# Altium project 10X SD CARD READER.PrjPcb
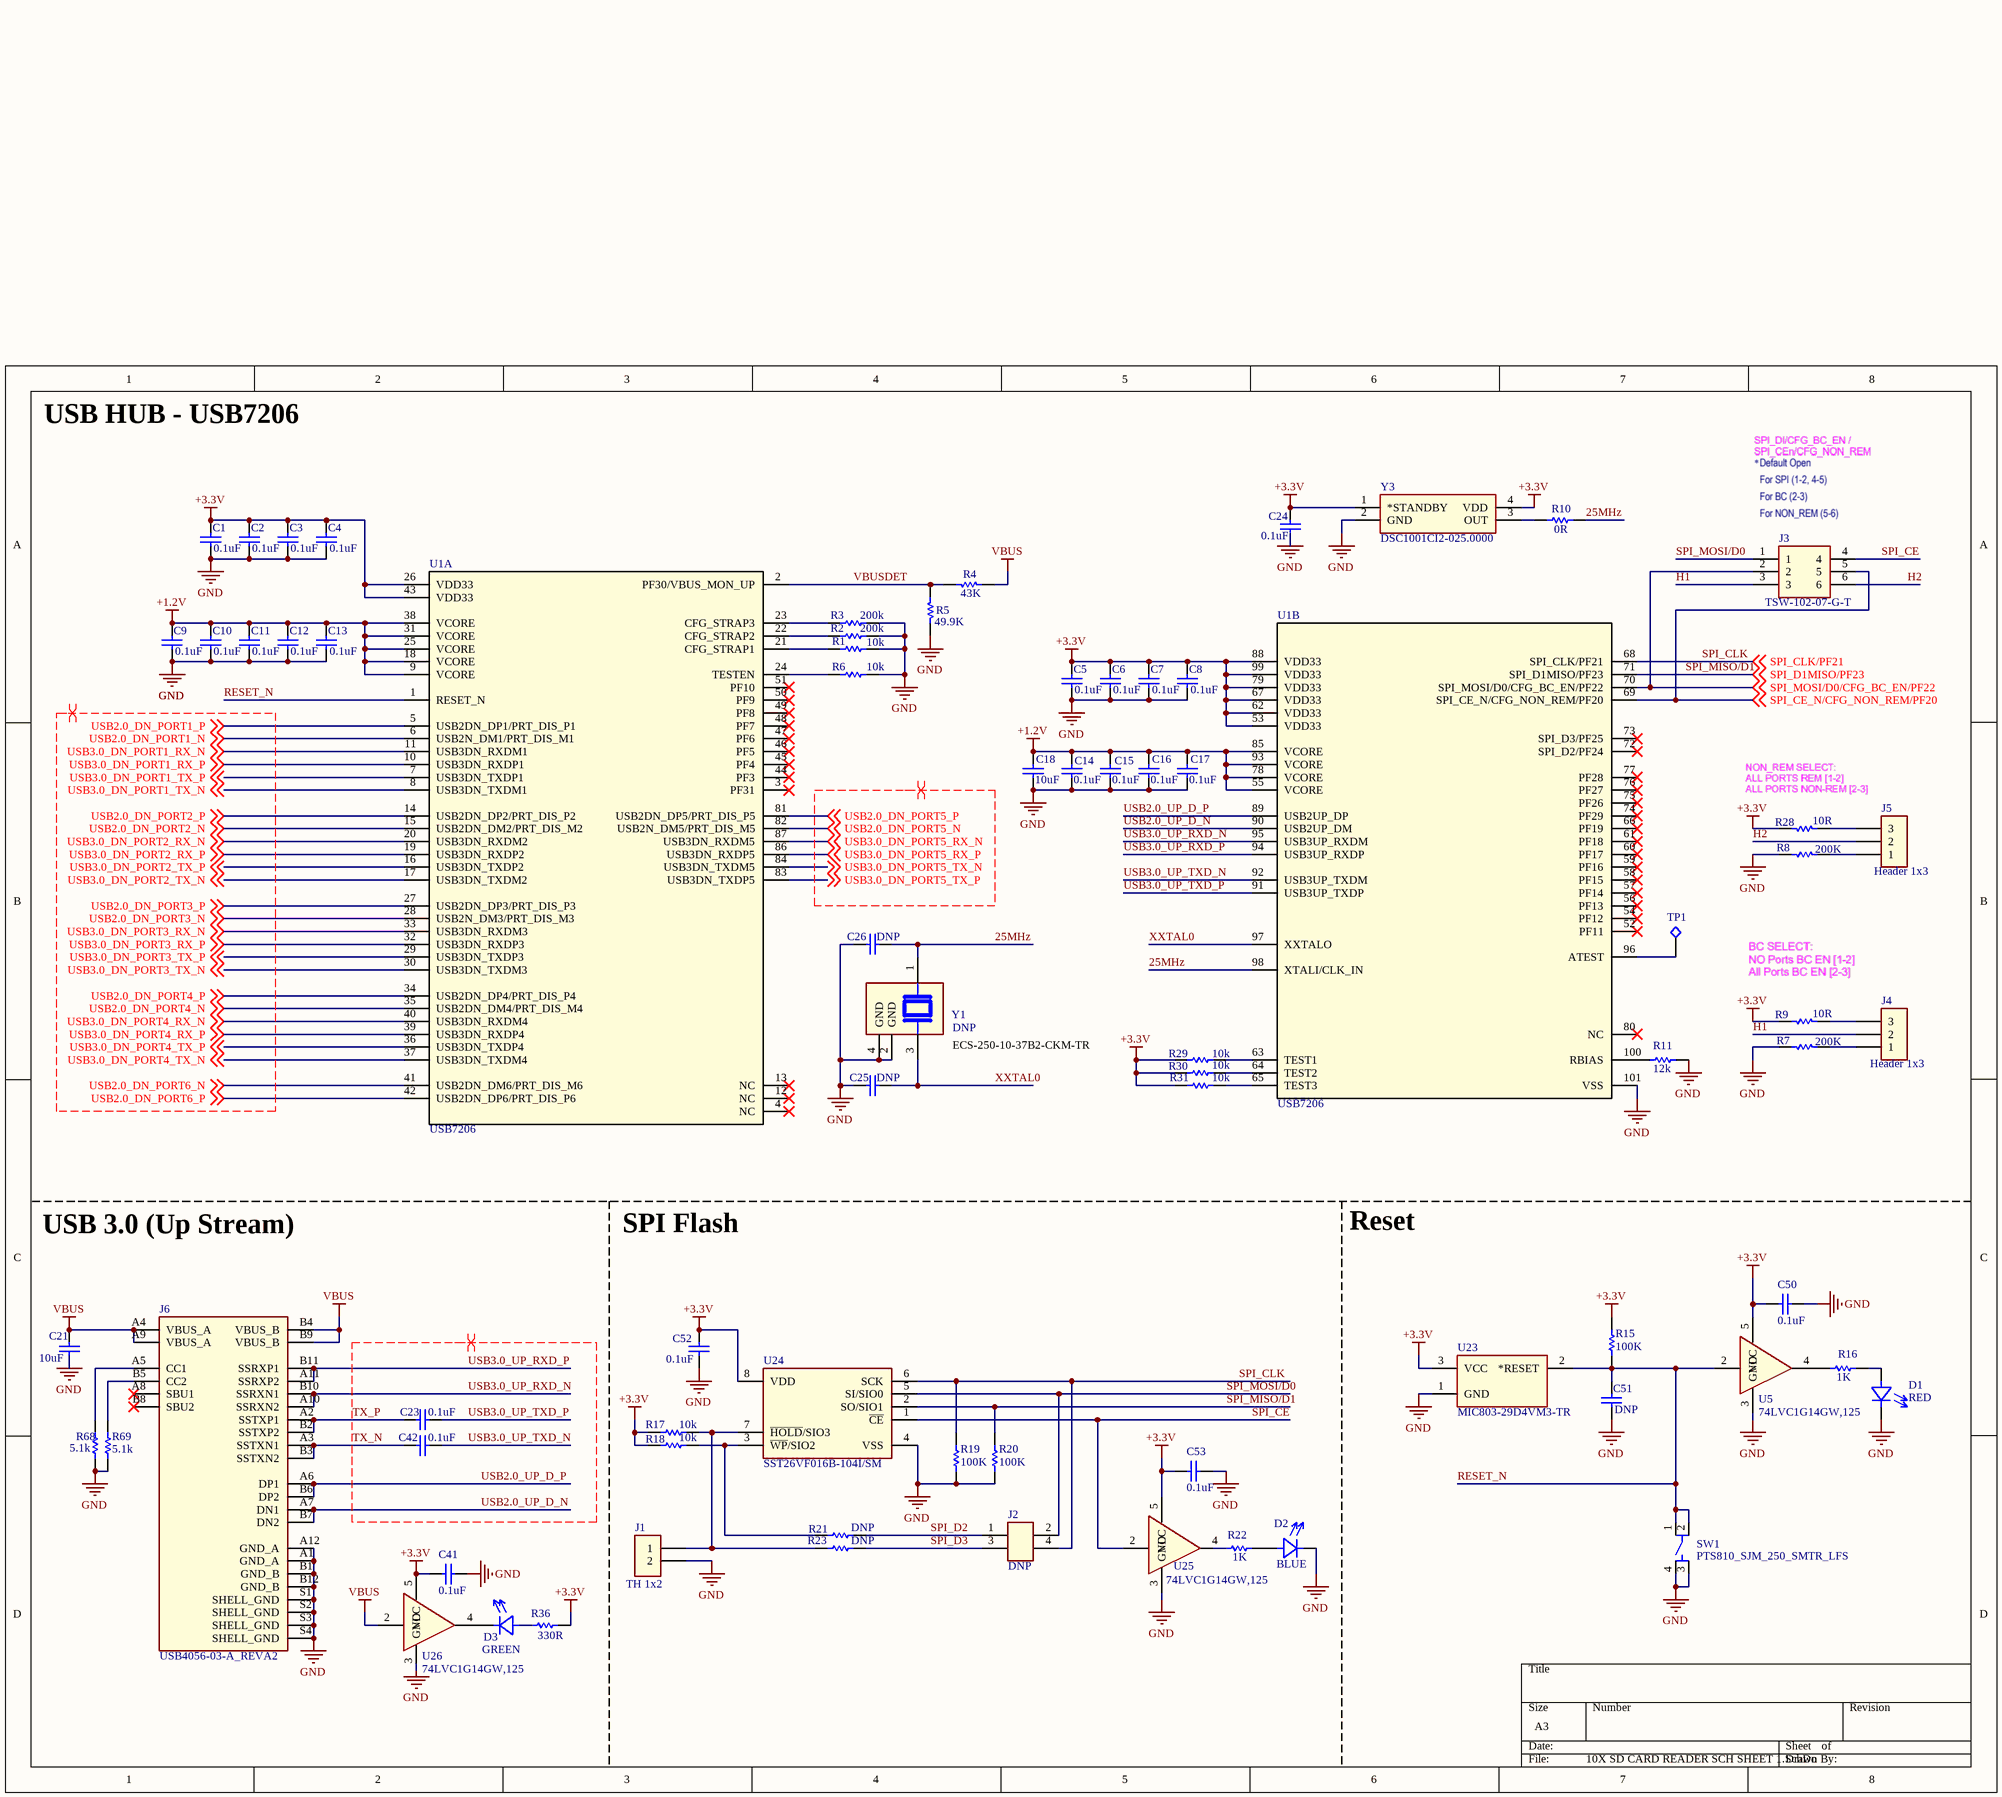
[diagram p0: 10X SD CARD READER SCH SHEET 1.SchDoc]
4 sheets, 309 parts. Net scope: global (net labels, ports and power ports of the same name join across sheets).
Board file: 10X SD CARD READER PCB.PcbDoc
Sheets:
  10X SD CARD READER SCH SHEET 1.SchDoc
  10X SD CARD READER SCH SHEET 2.SchDoc
  10X SD CARD READER SCH SHEET 3.SchDoc
  10X SD CARD READER SCH SHEET 4.SchDoc

## Sheet 10X SD CARD READER SCH SHEET 1.SchDoc
size A3

### Parts
C1  0.1uF  [C-0402/1005]
C2  0.1uF  [C-0402/1005]
C3  0.1uF  [C-0402/1005]
C4  0.1uF  [C-0402/1005]
C5  0.1uF  [C-0402/1005]
C6  0.1uF  [C-0402/1005]
C7  0.1uF  [C-0402/1005]
C8  0.1uF  [C-0402/1005]
C9  0.1uF  [C-0402/1005]
C10  0.1uF  [C-0402/1005]
C11  0.1uF  [C-0402/1005]
C12  0.1uF  [C-0402/1005]
C13  0.1uF  [C-0402/1005]
C14  0.1uF  [C-0402/1005]
C15  0.1uF  [C-0402/1005]
C16  0.1uF  [C-0402/1005]
C17  0.1uF  [C-0402/1005]
C18  10uF  [C-0805/2012]
C21  10uF  [C-0805/2012]
C23  0.1uF  [C-0402/1005]
C24  0.1uF  [C-0402/1005]
C25  DNP  [R-0402/1005]
C26  DNP  [R-0402/1005]
C41  0.1uF  [C-0402/1005]
C42  0.1uF  [C-0402/1005]
C50  0.1uF  [C-0402/1005]
C51  value DNP  [C-0402/1005]  (hidden comment: 0.1uF)
C52  0.1uF  [C-0402/1005]
C53  0.1uF  [C-0402/1005]
D1  RED  [LEDC1608X65N]
D2  BLUE  [LEDC1608X65N]
D3  GREEN  [LEDC1608X65N]
J1  TH 1x2  [PIN HEADER 1x2 2.54mm]
J2  DNP  [PIN HEADER 2x2 2.54mm]
J3  TSW-102-07-G-T  [CON6_3X2_TU_TSW_SAI]
J4  Header 1x3  [PIN HEADER 1x3 2.54mm]
J5  Header 1x3  [PIN HEADER 1x3 2.54mm]
J6  USB4056-03-A_REVA2  [GCT_USB4056-03-A_REVA2]
R1  10k  [R-0402/1005]
R2  200k  [R-0402/1005]
R3  200k  [R-0402/1005]
R4  43K  [R-0402/1005]
R5  49.9K  [R-0402/1005]
R6  10k  [R-0402/1005]
R7  200K  [R-0402/1005]
R8  200K  [R-0402/1005]
R9  10R  [R-0402/1005]
R10  0R  [R-0402/1005]
R11  12k  [R-0402/1005]
R15  100K  [R-0402/1005]
R16  1K  [R-0402/1005]
R17  10k  [R-0402/1005]
R18  10k  [R-0402/1005]
R19  100K  [R-0402/1005]
R20  100K  [R-0402/1005]
R21  DNP  [R-0402/1005]
R22  1K  [R-0402/1005]
R23  DNP  [R-0402/1005]
R28  10R  [R-0402/1005]
R29  10k  [R-0402/1005]
R30  10k  [R-0402/1005]
R31  10k  [R-0402/1005]
R36  330R  [R-0402/1005]
R68  5.1k  [R-0402/1005]
R69  5.1k  [R-0402/1005]
SW1  PTS810_SJM_250_SMTR_LFS  [SW_PTS810_SJM_250_SMTR_LFS]
TP1  Test Points  [Test Point TH Round H0.9,D1.6]  (value not drawn)
U1  USB7206  [USB7206]  (parts A,B of 2)
U5  74LVC1G14GW,125  [SOT65P212X110-5N]
U23  MIC803-29D4VM3-TR  [SOT-23_M3_MCH]
U24  SST26VF016B-104I/SM  [SOIC127P794X203-8N]
U25  74LVC1G14GW,125  [SOT65P212X110-5N]
U26  74LVC1G14GW,125  [SOT65P212X110-5N]
Y1  DNP  [ECS-250-10-37B2]
Y3  DSC1001CI2-025.0000  [CDFN4_3P2X2P5_MCH]

### Nets
+1.2V: C9.2 C10.2 C11.2 C12.2 C13.2 C14.1 C15.1 C16.2 C17.2 C18.2 U1.9(VCORE) U1.18(VCORE) U1.25(VCORE) U1.31(VCORE) U1.38(VCORE) U1.55(VCORE) U1.78(VCORE) U1.85(VCORE) U1.93(VCORE)
+3.3V: C1.2 C2.2 C3.2 C4.2 C5.2 C6.2 C7.2 C8.2 C24.2 C41.2 C50.2 C52.2 C53.2 R9.2 R15.1 R17.2 R18.2 R28.2 R29.2 R30.2 R31.2 R36.2 U1.26(VDD33) U1.43(VDD33) U1.53(VDD33) U1.62(VDD33) U1.67(VDD33) U1.79(VDD33) U1.88(VDD33) U1.99(VDD33) U5.5(VCC) U23.3(VCC) U24.8(VDD) U25.5(VCC) U26.5(VCC) Y3.1(*STANDBY) Y3.4(VDD)
GND: C1.1 C2.1 C3.1 C4.1 C5.1 C6.1 C7.1 C8.1 C9.1 C10.1 C11.1 C12.1 C13.1 C14.2 C15.2 C16.1 C17.1 C18.1 C21.1 C24.1 C25.2 C26.2 C41.1 C50.1 C51.1 C52.1 C53.1 D1.C D2.C J1.2 J6.A1(GND_A) J6.A12(GND_A) J6.B1(GND_B) J6.B12(GND_B) J6.S1(SHELL_GND) J6.S2(SHELL_GND) J6.S3(SHELL_GND) J6.S4(SHELL_GND) R1.2 R2.2 R3.2 R5.2 R6.1 R7.1 R8.1 R11.1 R19.2 R20.2 R68.1 R69.1 SW1.3 SW1.4 U1.101(VSS) U5.3(GND) U23.1(GND) U24.4(VSS) U25.3(GND) U26.3(GND) Y1.2(GND) Y1.4(GND) Y3.2(GND)
VBUS: C21.2 J6.A4(VBUS_A) J6.A9(VBUS_A) J6.B4(VBUS_B) J6.B9(VBUS_B) R4.2 U26.2(A)
25MHz: C26.1 R10.2 U1.98(XTALI/CLK_IN) Y1.1
H1: J3.3 J4.2
H2: J3.6 J5.2
RESET_N: C51.2 R15.2 SW1.1 SW1.2 U1.1(RESET_N) U5.2(A) U23.2(*RESET)
SPI_CE: J3.4 U24.1(~{CE}) U25.2(A)
SPI_CE_N/CFG_NON_REM/PF20: J3.5 U1.69(SPI_CE_N/CFG_NON_REM/PF20) ; off-sheet SPI_CE_N/CFG_NON_REM/PF20
SPI_CLK: J2.4 R19.1 U1.68(SPI_CLK/PF21) U24.6(SCK) ; off-sheet SPI_CLK/PF21  [also labelled SPI_CLK/PF21]
SPI_D2: J2.1 R21.2
SPI_D3: J2.3 R23.2
SPI_MISO/D1: R20.1 U1.71(SPI_D1MISO/PF23) U24.2(SO/SIO1) ; off-sheet SPI_D1MISO/PF23  [also labelled SPI_D1MISO/PF23]
SPI_MOSI/D0: J2.2 J3.1 U24.5(SI/SIO0)
SPI_MOSI/D0/CFG_BC_EN/PF22: J3.2 U1.70(SPI_MOSI/D0/CFG_BC_EN/PF22) ; off-sheet SPI_MOSI/D0/CFG_BC_EN/PF22
TX_N: C42.2 J6.A3(SSTXN1) J6.B3(SSTXN2)
TX_P: C23.2 J6.A2(SSTXP1) J6.B2(SSTXP2)
USB2.0_DN_PORT1_N: U1.6(USB2N_DM1/PRT_DIS_M1) ; off-sheet USB2.0_DN_PORT1_N
USB2.0_DN_PORT1_P: U1.5(USB2DN_DP1/PRT_DIS_P1) ; off-sheet USB2.0_DN_PORT1_P
USB2.0_DN_PORT2_N: U1.15(USB2DN_DM2/PRT_DIS_M2) ; off-sheet USB2.0_DN_PORT2_N
USB2.0_DN_PORT2_P: U1.14(USB2DN_DP2/PRT_DIS_P2) ; off-sheet USB2.0_DN_PORT2_P
USB2.0_DN_PORT3_N: U1.28(USB2N_DM3/PRT_DIS_M3) ; off-sheet USB2.0_DN_PORT3_N
USB2.0_DN_PORT3_P: U1.27(USB2DN_DP3/PRT_DIS_P3) ; off-sheet USB2.0_DN_PORT3_P
USB2.0_DN_PORT4_N: U1.35(USB2DN_DM4/PRT_DIS_M4) ; off-sheet USB2.0_DN_PORT4_N
USB2.0_DN_PORT4_P: U1.34(USB2DN_DP4/PRT_DIS_P4) ; off-sheet USB2.0_DN_PORT4_P
USB2.0_DN_PORT5_N: U1.82(USB2N_DM5/PRT_DIS_M5) ; off-sheet USB2.0_DN_PORT5_N
USB2.0_DN_PORT5_P: U1.81(USB2DN_DP5/PRT_DIS_P5) ; off-sheet USB2.0_DN_PORT5_P
USB2.0_DN_PORT6_N: U1.41(USB2DN_DM6/PRT_DIS_M6) ; off-sheet USB2.0_DN_PORT6_N
USB2.0_DN_PORT6_P: U1.42(USB2DN_DP6/PRT_DIS_P6) ; off-sheet USB2.0_DN_PORT6_P
USB2.0_UP_D_N: J6.A7(DN1) J6.B7(DN2) U1.90(USB2UP_DM)
USB2.0_UP_D_P: J6.A6(DP1) J6.B6(DP2) U1.89(USB2UP_DP)
USB3.0_DN_PORT1_RX_N: U1.11(USB3DN_RXDM1) ; off-sheet USB3.0_DN_PORT1_RX_N
USB3.0_DN_PORT1_RX_P: U1.10(USB3DN_RXDP1) ; off-sheet USB3.0_DN_PORT1_RX_P
USB3.0_DN_PORT1_TX_N: U1.8(USB3DN_TXDM1) ; off-sheet USB3.0_DN_PORT1_TX_N
USB3.0_DN_PORT1_TX_P: U1.7(USB3DN_TXDP1) ; off-sheet USB3.0_DN_PORT1_TX_P
USB3.0_DN_PORT2_RX_N: U1.20(USB3DN_RXDM2) ; off-sheet USB3.0_DN_PORT2_RX_N
USB3.0_DN_PORT2_RX_P: U1.19(USB3DN_RXDP2) ; off-sheet USB3.0_DN_PORT2_RX_P
USB3.0_DN_PORT2_TX_N: U1.17(USB3DN_TXDM2) ; off-sheet USB3.0_DN_PORT2_TX_N
USB3.0_DN_PORT2_TX_P: U1.16(USB3DN_TXDP2) ; off-sheet USB3.0_DN_PORT2_TX_P
USB3.0_DN_PORT3_RX_N: U1.33(USB3DN_RXDM3) ; off-sheet USB3.0_DN_PORT3_RX_N
USB3.0_DN_PORT3_RX_P: U1.32(USB3DN_RXDP3) ; off-sheet USB3.0_DN_PORT3_RX_P
USB3.0_DN_PORT3_TX_N: U1.30(USB3DN_TXDM3) ; off-sheet USB3.0_DN_PORT3_TX_N
USB3.0_DN_PORT3_TX_P: U1.29(USB3DN_TXDP3) ; off-sheet USB3.0_DN_PORT3_TX_P
USB3.0_DN_PORT4_RX_N: U1.40(USB3DN_RXDM4) ; off-sheet USB3.0_DN_PORT4_RX_N
USB3.0_DN_PORT4_RX_P: U1.39(USB3DN_RXDP4) ; off-sheet USB3.0_DN_PORT4_RX_P
USB3.0_DN_PORT4_TX_N: U1.37(USB3DN_TXDM4) ; off-sheet USB3.0_DN_PORT4_TX_N
USB3.0_DN_PORT4_TX_P: U1.36(USB3DN_TXDP4) ; off-sheet USB3.0_DN_PORT4_TX_P
USB3.0_DN_PORT5_RX_N: U1.87(USB3DN_RXDM5) ; off-sheet USB3.0_DN_PORT5_RX_N
USB3.0_DN_PORT5_RX_P: U1.86(USB3DN_RXDP5) ; off-sheet USB3.0_DN_PORT5_RX_P
USB3.0_DN_PORT5_TX_N: U1.84(USB3DN_TXDM5) ; off-sheet USB3.0_DN_PORT5_TX_N
USB3.0_DN_PORT5_TX_P: U1.83(USB3DN_TXDP5) ; off-sheet USB3.0_DN_PORT5_TX_P
USB3.0_UP_RXD_N: J6.A10(SSRXN2) J6.B10(SSRXN1) U1.95(USB3UP_RXDM)
USB3.0_UP_RXD_P: J6.A11(SSRXP2) J6.B11(SSRXP1) U1.94(USB3UP_RXDP)
USB3.0_UP_TXD_N: C42.1 U1.92(USB3UP_TXDM)
USB3.0_UP_TXD_P: C23.1 U1.91(USB3UP_TXDP)
VBUSDET: R4.1 R5.1 U1.2(PF30/VBUS_MON_UP)
XXTAL0: C25.1 U1.97(XXTALO) Y1.3
NetD1_A: D1.A R16.1
NetD2_A: D2.A R22.1
NetD3_A: D3.A R36.1
NetD3_C: D3.C U26.4(~{Y})
NetJ1_1: J1.1 R17.1 R23.1 U24.7(~{HOLD}/SIO3)
NetJ4_1: J4.1 R7.2
NetJ4_3: J4.3 R9.1
NetJ5_1: J5.1 R8.2
NetJ5_3: J5.3 R28.1
NetJ6_A5: J6.A5(CC1) R68.2
NetJ6_B5: J6.B5(CC2) R69.2
NetR1_1: R1.1 U1.21(CFG_STRAP1)
NetR2_1: R2.1 U1.22(CFG_STRAP2)
NetR3_1: R3.1 U1.23(CFG_STRAP3)
NetR6_2: R6.2 U1.24(TESTEN)
NetR10_1: R10.1 Y3.3(OUT)
NetR11_2: R11.2 U1.100(RBIAS)
NetR16_2: R16.2 U5.4(~{Y})
NetR18_1: R18.1 R21.1 U24.3(~{WP}/SIO2)
NetR22_2: R22.2 U25.4(~{Y})
NetR29_1: R29.1 U1.63(TEST1)
NetR30_1: R30.1 U1.64(TEST2)
NetR31_1: R31.1 U1.65(TEST3)
NetTP1_1: TP1.1 U1.96(ATEST)

Not connected (* = marked no-connect by the designer): J6 A8(SBU1)* B8(SBU2)*; U1 3(PF31)* 4(NC)* 12(NC)* 13(NC)* 44(PF3)* 45(PF4)* 46(PF5)* 47(PF6)* 48(PF7)* 49(PF8)* 50(PF9)* 51(PF10)* 52(PF11)* 54(PF12)* 56(PF13)* 57(PF14)* 58(PF15)* 59(PF16)* 60(PF17)* 61(PF18)* 66(PF19)* 72(SPI_D2/PF24)* 73(SPI_D3/PF25)* 74(PF29)* 75(PF26)* 76(PF27)* 77(PF28)* 80(NC)*

### Layout directives
differential pair; differential pair class Diff_90R: TX_N, TX_P, USB2.0_DN_PORT1_N, USB2.0_DN_PORT1_P, USB2.0_DN_PORT2_N, USB2.0_DN_PORT2_P, USB2.0_DN_PORT3_N, USB2.0_DN_PORT3_P, USB2.0_DN_PORT4_N, USB2.0_DN_PORT4_P, USB2.0_DN_PORT5_N, USB2.0_DN_PORT5_P, USB2.0_DN_PORT6_N, USB2.0_DN_PORT6_P, USB2.0_UP_D_N, USB2.0_UP_D_P, USB3.0_DN_PORT1_RX_N, USB3.0_DN_PORT1_RX_P, USB3.0_DN_PORT1_TX_N, USB3.0_DN_PORT1_TX_P, USB3.0_DN_PORT2_RX_N, USB3.0_DN_PORT2_RX_P, USB3.0_DN_PORT2_TX_N, USB3.0_DN_PORT2_TX_P, USB3.0_DN_PORT3_RX_N, USB3.0_DN_PORT3_RX_P, USB3.0_DN_PORT3_TX_N, USB3.0_DN_PORT3_TX_P, USB3.0_DN_PORT4_RX_N, USB3.0_DN_PORT4_RX_P, USB3.0_DN_PORT4_TX_N, USB3.0_DN_PORT4_TX_P, USB3.0_DN_PORT5_RX_N, USB3.0_DN_PORT5_RX_P, USB3.0_DN_PORT5_TX_N, USB3.0_DN_PORT5_TX_P, USB3.0_UP_RXD_N, USB3.0_UP_RXD_P, USB3.0_UP_TXD_N, USB3.0_UP_TXD_P

### Notes on the sheet
- USB HUB - USB7206
- (near Y1) ECS-250-10-37B2-CKM-TR
- USB 3.0 (Up Stream)
- SPI Flash
- Reset

### Library data of the parts
C1-C18 C23 C24 C41 C42 C50-C53 = Cap: Capacitor; Published: 8-Jun-2000; LatestRevisionDate: 17-Jul-2002; LatestRevisionNote: Re-released for DXP Platform.; PackageReference: RAD-0.3; Publisher: Altium Limited; PackageDescription: Radial Cap, Thru-Hole; 2 Leads; 0.3 in Pin Spacing
  C1-C17 C23 C24 C41 C42 C50 C52 C53: Value: 0.1uF
  C18: Value: 10uF
C21 C25 C26 = Cap: Capacitor; Value: 0.1uF; Published: 8-Jun-2000; LatestRevisionDate: 17-Jul-2002; LatestRevisionNote: Re-released for DXP Platform.; PackageReference: RAD-0.3; Publisher: Altium Limited; PackageDescription: Radial Cap, Thru-Hole; 2 Leads; 0.3 in Pin Spacing
D1-D3 = Diode-LED: Supplier: Digikey Electronics
J1 = Header 1x2: CONN HEADER VERT 3POS 2.54MM; Mfr. Part No.: 75160-156-03LF; Value: 51R; Unit Price (USD): 0.74; Supplier Part No.: 609-75160-156-03LF-ND; Supplier: Digikey Electronics
J2 = Header 2x2: FIXED IND 22UH 620MA 350 MOHM; Mfr. Part No.: PH2-04-UA; Unit Price (USD): 0.1; Supplier Part No.: 2057-PH2-04-UA-ND; Supplier: Digikey Electronics
J3 = TSW-102-07-G-T: No Description Available; Mfr_Name: Samtec Inc; Copyright: Copyright (C) 2023 Ultra Librarian. All rights reserved.; Manufacturer_Part_Number: TSW-102-07-G-T; Digi-Key_Part_Number_1: TSW-102-07-G-T-ND; RefDes: RefDes; Type: DEV
J4 J5 = Header 1x3: CONN HEADER VERT 3POS 2.54MM; Mfr. Part No.: 75160-156-03LF; Value: 51R; Unit Price (USD): 0.74; Supplier Part No.: 609-75160-156-03LF-ND; Supplier: Digikey Electronics
J6 = USB4056-03-A_REVA2: USB-C (USB TYPE-C) USB 3.2 Gen 2 (USB 3.1 Gen 2, Superspeed + (USB 3.1)) Receptacle Connector 24 Position Surface Mount, Right Angle; Through Hole; MF: Global Connector Technology; Package: None; Check_prices: https://www.snapeda.com/parts/USB4056-03-A/Global+Connector+Technology/view-part/?ref=eda; Value: *; Availability: In Stock; SnapEDA_Link: https://www.snapeda.com/parts/USB4056-03-A/Global+Connector+Technology/view-part/?ref=snap; MP: USB4056-03-A; Price: None
R1-R3 R6 R17 R18 R29-R31 = Res1: Resistor; Published: 8-Jun-2000; LatestRevisionDate: 17-Jul-2002; LatestRevisionNote: Re-released for DXP Platform.; PackageReference: AXIAL-0.3; Publisher: Altium Limited; PackageDescription: Axial Device, Thru-Hole; 2 Leads; 0.3 in Pin Spacing
  R1 R6 R17 R18 R29-R31: Value: 10K
  R2 R3: Value: 200K
R4 R5 R7-R9 R11 R15 R16 R19 R20 R22 R28 R36 = Res1: Resistor; Value: 10K; Published: 8-Jun-2000; LatestRevisionDate: 17-Jul-2002; LatestRevisionNote: Re-released for DXP Platform.; PackageReference: AXIAL-0.3; Publisher: Altium Limited; PackageDescription: Axial Device, Thru-Hole; 2 Leads; 0.3 in Pin Spacing
R10 R21 R23 R68 R69 = Res1: Resistor; Value: 200K; Published: 8-Jun-2000; LatestRevisionDate: 17-Jul-2002; LatestRevisionNote: Re-released for DXP Platform.; PackageReference: AXIAL-0.3; Publisher: Altium Limited; PackageDescription: Axial Device, Thru-Hole; 2 Leads; 0.3 in Pin Spacing
SW1 = PTS810_SJM_250_SMTR_LFS: Tactile Switch SPST-NO Top Actuated Surface Mount; MF: C&K; MP: PTS810 SJM 250 SMTR LFS; Price: None; Package: None; Availability: Unavailable; Value: *; SnapEDA_Link: https://www.snapeda.com/parts/PTS810%20SJM%20250%20SMTR%20LFS/C%26K/view-part/522770/?ref=snap
U1 = USB7206: IC USB3.1 GEN2 HUB TYPE C; Manufacturer: Microchip Technology; Manufacturer Product Number: USB7206CT-I/KDX; Digi-Key Part Number: 150-USB7206CT-I/KDXTR-ND; Unit Price: $12.9; Stock: 4935
U5 U25 U26 = 74LVC1G14GW,125: Inverter Schmitt Trigger 1-Element CMOS 5-Pin TSSOP T/R; Price: None; Availability: Unavailable; MP: 74LVC1G14GW,125; Value: *; Package: None
U23 = MIC803-29D4VM3-TR: No Description Available; Mfr_Name: Microchip; Copyright: Copyright (C) 2023 Ultra Librarian. All rights reserved.; Manufacturer_Part_Number: MIC803-29D4VM3-TR; Digi-Key_Part_Number_1: 576-3806-1-ND; Digi-Key_Part_Number_2: 576-3806-2-ND; Digi-Key_Part_Number_3: 576-3806-6-ND; RefDes: RefDes; Type: DEV
Y1 = ECS-250-10-37B2-CKM-TR
Y3 = DSC1001CI2-025.0000: No Description Available; Mfr_Name: Microchip; Copyright: Copyright (C) 2023 Ultra Librarian. All rights reserved.; Manufacturer_Part_Number: DSC1001CI2-025.0000; Digi-Key_Part_Number_1: 576-4957-5-ND; RefDes: RefDes; Type: DEV

## Sheet 10X SD CARD READER SCH SHEET 2.SchDoc
size A3
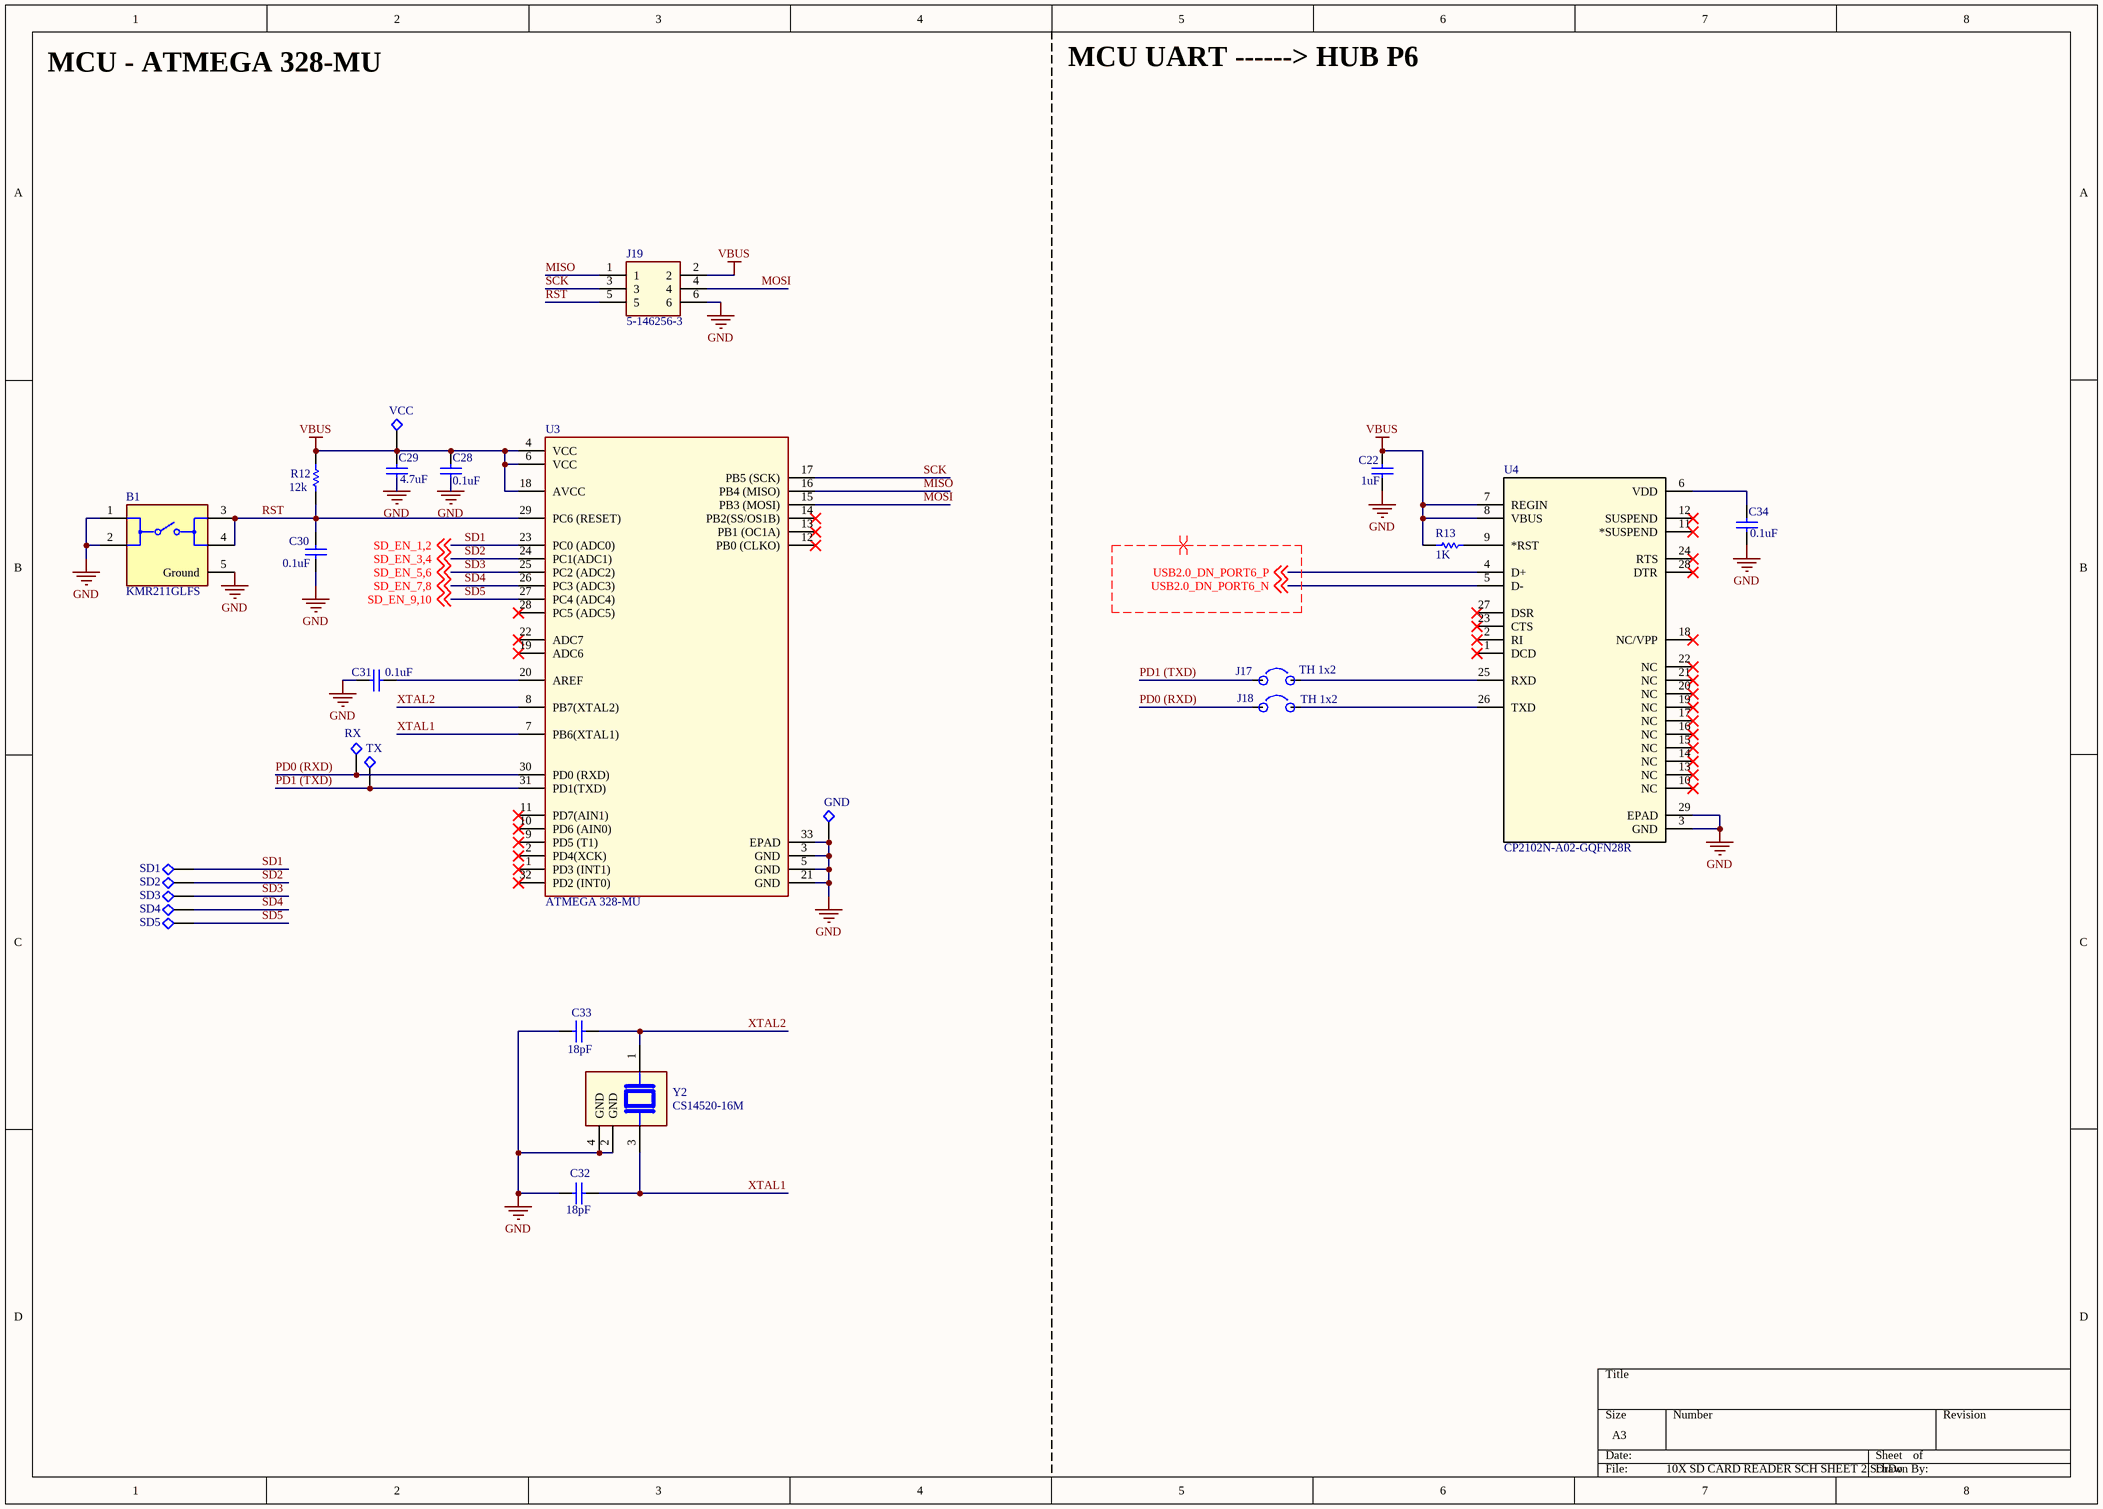
[diagram p1: 10X SD CARD READER SCH SHEET 2.SchDoc]

### Parts
B1  KMR211GLFS  [FP-KMR211GLFS-MFG]
C22  1uF  [C-0402/1005]
C28  0.1uF  [C-0402/1005]
C29  4.7uF  [0805-CAP]
C30  0.1uF  [C-0402/1005]
C31  0.1uF  [C-0402/1005]
C32  18pF  [C-0402/1005]
C33  18pF  [C-0402/1005]
C34  0.1uF  [C-0402/1005]
GND  Test Points  [Test Point TH Round H0.9,D1.6]  (value not drawn)
J17  TH 1x2  [PIN HEADER 1x2 2.54mm]
J18  TH 1x2  [PIN HEADER 1x2 2.54mm]
J19  5-146256-3  [TE_5-146256-3]
R12  12k  [R-0402/1005]
R13  1K  [R-0402/1005]
RX  Test Points  [Test Point TH Round H0.9,D1.6]  (value not drawn)
SD1  Test Points  [Test Point TH Round H0.9,D1.6]  (value not drawn)
SD2  Test Points  [Test Point TH Round H0.9,D1.6]  (value not drawn)
SD3  Test Points  [Test Point TH Round H0.9,D1.6]  (value not drawn)
SD4  Test Points  [Test Point TH Round H0.9,D1.6]  (value not drawn)
SD5  Test Points  [Test Point TH Round H0.9,D1.6]  (value not drawn)
TX  Test Points  [Test Point TH Round H0.9,D1.6]  (value not drawn)
U3  ATMEGA 328-MU  [ATMEGA 328P]
U4  CP2102N-A02-GQFN28R  [CP2102]
VCC  Test Points  [Test Point TH Round H0.9,D1.6]  (value not drawn)
Y2  CS14520-16M  [FL1600044]

### Nets
GND: B1.1 B1.2 B1.5(Ground) C22.2 C28.2 C29.2 C30.1 C31.1 C32.2 C33.2 C34.2 GND.1 J19.6 U3.3(GND) U3.5(GND) U3.21(GND) U3.33(EPAD) U4.3(GND) U4.29(EPAD) Y2.2(GND) Y2.4(GND)
VBUS: C22.1 C28.1 C29.1 J19.2 R12.1 R13.1 U3.4(VCC) U3.6(VCC) U3.18(AVCC) U4.7(REGIN) U4.8(VBUS) VCC.1
MISO: J19.1 U3.16(PB4_(MISO))
MOSI: J19.4 U3.15(PB3_(MOSI))
PD0 (RXD): J18.1 RX.1 U3.30(PD0_(RXD))
PD1 (TXD): J17.1 TX.1 U3.31(PD1(TXD))
RST: B1.3 B1.4 C30.2 J19.5 R12.2 U3.29(PC6_(RESET))
SCK: J19.3 U3.17(PB5_(SCK))
SD1: SD1.1 U3.23(PC0_(ADC0)) ; off-sheet SD_EN_1,2  [also labelled SD_EN_1,2]
SD2: SD2.1 U3.24(PC1(ADC1)) ; off-sheet SD_EN_3,4  [also labelled SD_EN_3,4]
SD3: SD3.1 U3.25(PC2_(ADC2)) ; off-sheet SD_EN_5,6  [also labelled SD_EN_5,6]
SD4: SD4.1 U3.26(PC3_(ADC3)) ; off-sheet SD_EN_7,8  [also labelled SD_EN_7,8]
SD5: SD5.1 U3.27(PC4_(ADC4)) ; off-sheet SD_EN_9,10  [also labelled SD_EN_9,10]
USB2.0_DN_PORT6_N: U4.5(D-) ; off-sheet USB2.0_DN_PORT6_N
USB2.0_DN_PORT6_P: U4.4(D+) ; off-sheet USB2.0_DN_PORT6_P
XTAL1: C32.1 U3.7(PB6(XTAL1)) Y2.3
XTAL2: C33.1 U3.8(PB7(XTAL2)) Y2.1
NetC31_2: C31.2 U3.20(AREF)
NetC34_1: C34.1 U4.6(VDD)
NetJ17_2: J17.2 U4.25(RXD)
NetJ18_2: J18.2 U4.26(TXD)
NetR13_2: R13.2 U4.9(*RST)

Not connected (* = marked no-connect by the designer): U3 1(PD3_(INT1))* 2(PD4(XCK))* 9(PD5_(T1))* 10(PD6_(AIN0))* 11(PD7(AIN1))* 12(PB0_(CLKO))* 13(PB1_(OC1A))* 14(PB2(SS/OS1B))* 19(ADC6)* 22(ADC7)* 28(PC5_(ADC5))* 32(PD2_(INT0))*; U4 1(DCD)* 2(RI)* 10(NC)* 11(*SUSPEND)* 12(SUSPEND)* 13(NC)* 14(NC)* 15(NC)* 16(NC)* 17(NC)* 18(NC/VPP)* 19(NC)* 20(NC)* 21(NC)* 22(NC)* 23(CTS)* 24(RTS)* 27(DSR)* 28(DTR)*

### Layout directives
differential pair; differential pair class Diff_90R: USB2.0_DN_PORT6_N, USB2.0_DN_PORT6_P

### Notes on the sheet
- MCU - ATMEGA 328-MU
- MCU UART ------> HUB P6

### Library data of the parts
B1 = CMP-10040-000023-1: SWITCH TACTILE SPST-NO 0.05A 32V; Switch Function: Off-Mom; Throw Configuration: SPST; Switch Travel: 0.2mm; Current Rating: 50mA; Illumination Type: Non-Illuminated; Actuator Length: 0.5mm; Power Rating: 1W; Operating Force: 1.2N; Actuator Type: Standard; Mechanical Life: 200000Cycles; REACH SVHC: No SVHC; Voltage Rating (DC): 32V; Length: 2.8mm; Min Operating Temperature: -40°C; Mount: Surface Mount; Max Voltage Rating (DC): 32V; Width: 2.8mm; Depth: 4.6mm; Packaging: Tape and Reel; Lead Free: Lead Free; Contact Material: Silver; Termination: Gull Wing; Package Quantity: 1; Contact Current Rating: 50mA; Orientation: Straight; Max Operating Temperature: 85°C; Radiation Hardening: No; Max Current Rating: 50mA; Contact Plating: Silver
C22 C34 = Cap: Capacitor; Value: 4.7uF; Published: 8-Jun-2000; LatestRevisionDate: 17-Jul-2002; LatestRevisionNote: Re-released for DXP Platform.; PackageReference: RAD-0.3; Publisher: Altium Limited; PackageDescription: Radial Cap, Thru-Hole; 2 Leads; 0.3 in Pin Spacing
C28 = Cap: Capacitor; Value: 100nF; Published: 8-Jun-2000; LatestRevisionDate: 17-Jul-2002; LatestRevisionNote: Re-released for DXP Platform.; PackageReference: RAD-0.3; Publisher: Altium Limited; PackageDescription: Radial Cap, Thru-Hole; 2 Leads; 0.3 in Pin Spacing
C29-C31 = Cap: Capacitor; Published: 8-Jun-2000; LatestRevisionDate: 17-Jul-2002; LatestRevisionNote: Re-released for DXP Platform.; PackageReference: RAD-0.3; Publisher: Altium Limited; PackageDescription: Radial Cap, Thru-Hole; 2 Leads; 0.3 in Pin Spacing
  C29: Value: 4.7uF
  C30 C31: Value: 0.1uF
C32 C33 = Cap: Capacitor; Value: 0.1uF; Published: 8-Jun-2000; LatestRevisionDate: 17-Jul-2002; LatestRevisionNote: Re-released for DXP Platform.; PackageReference: RAD-0.3; Publisher: Altium Limited; PackageDescription: Radial Cap, Thru-Hole; 2 Leads; 0.3 in Pin Spacing
J17 J18 = Jumper 2 pin: CONN HEADER VERT 3POS 2.54MM; Mfr. Part No.: 75160-156-03LF; Value: 51R; Unit Price (USD): 0.74; Supplier Part No.: 609-75160-156-03LF-ND; Supplier: Digikey Electronics
J19 = 5-146256-3: Header; Breakaway; 0.100 x 0.100 in.; PC Board; Dual; 6; 0.025 in.; 0.12 in.; Centerline_Pitch: 2.54 mm[.1 in]; Number_of_Positions: 6; MF: TE Connectivity; Product_Type: Connector; TE_purchase_URL: https://www.te.com/usa-en/product-5-146256-3.html?te_bu=Cor&te_type=disp&te_campaign=seda_glo_cor-seda-global-disp-prtnr-fy19-seda-model-bom-cta_sma-317_1&elqCampaignId=32493; SnapEDA_Link: https://www.snapeda.com/parts/5-146256-3/TE%20Connectivity/view-part/486039/?ref=snap; EU_RoHS_Compliance: Compliant; MP: 5-146256-3; Value: *; Package: None; Digi-Key_Part_Number: A121369-ND; Digi-Key_Purchase_URL: https://www.digikey.com/product-detail/en/te-connectivity-amp-connectors/5-146256-3/A121369-ND/1153559?utm_source=snapeda&utm_medium=aggregator&utm_campaign=symbol
R12 R13 = Res1: Resistor; Value: 100K; Published: 8-Jun-2000; LatestRevisionDate: 17-Jul-2002; LatestRevisionNote: Re-released for DXP Platform.; PackageReference: AXIAL-0.3; Publisher: Altium Limited; PackageDescription: Axial Device, Thru-Hole; 2 Leads; 0.3 in Pin Spacing
U3 = ATMEGA 328-MU: IC MCU 8BIT 32KB FLASH 32VQFN; Manufacturer: Microchip Technology; Manufacturer Product Number: ATMEGA328P-MU; Digi-Key Part Number: ATMEGA328P-MU-ND; Unit Price: $ 2.42; Stock: 6187
U4 = CP2102: USB Bridge, USB to UART USB 2.0 UART Interface; Manufacturer: Silicon Labs; Manufacturer Product Number: CP2102N-A02-GQFN28R; Digi-Key Part Number: 336-5890-2-ND; Unit Price: $4.66; Stock: 45696
Y2 = FL1600044

## Sheet 10X SD CARD READER SCH SHEET 3.SchDoc
size A2
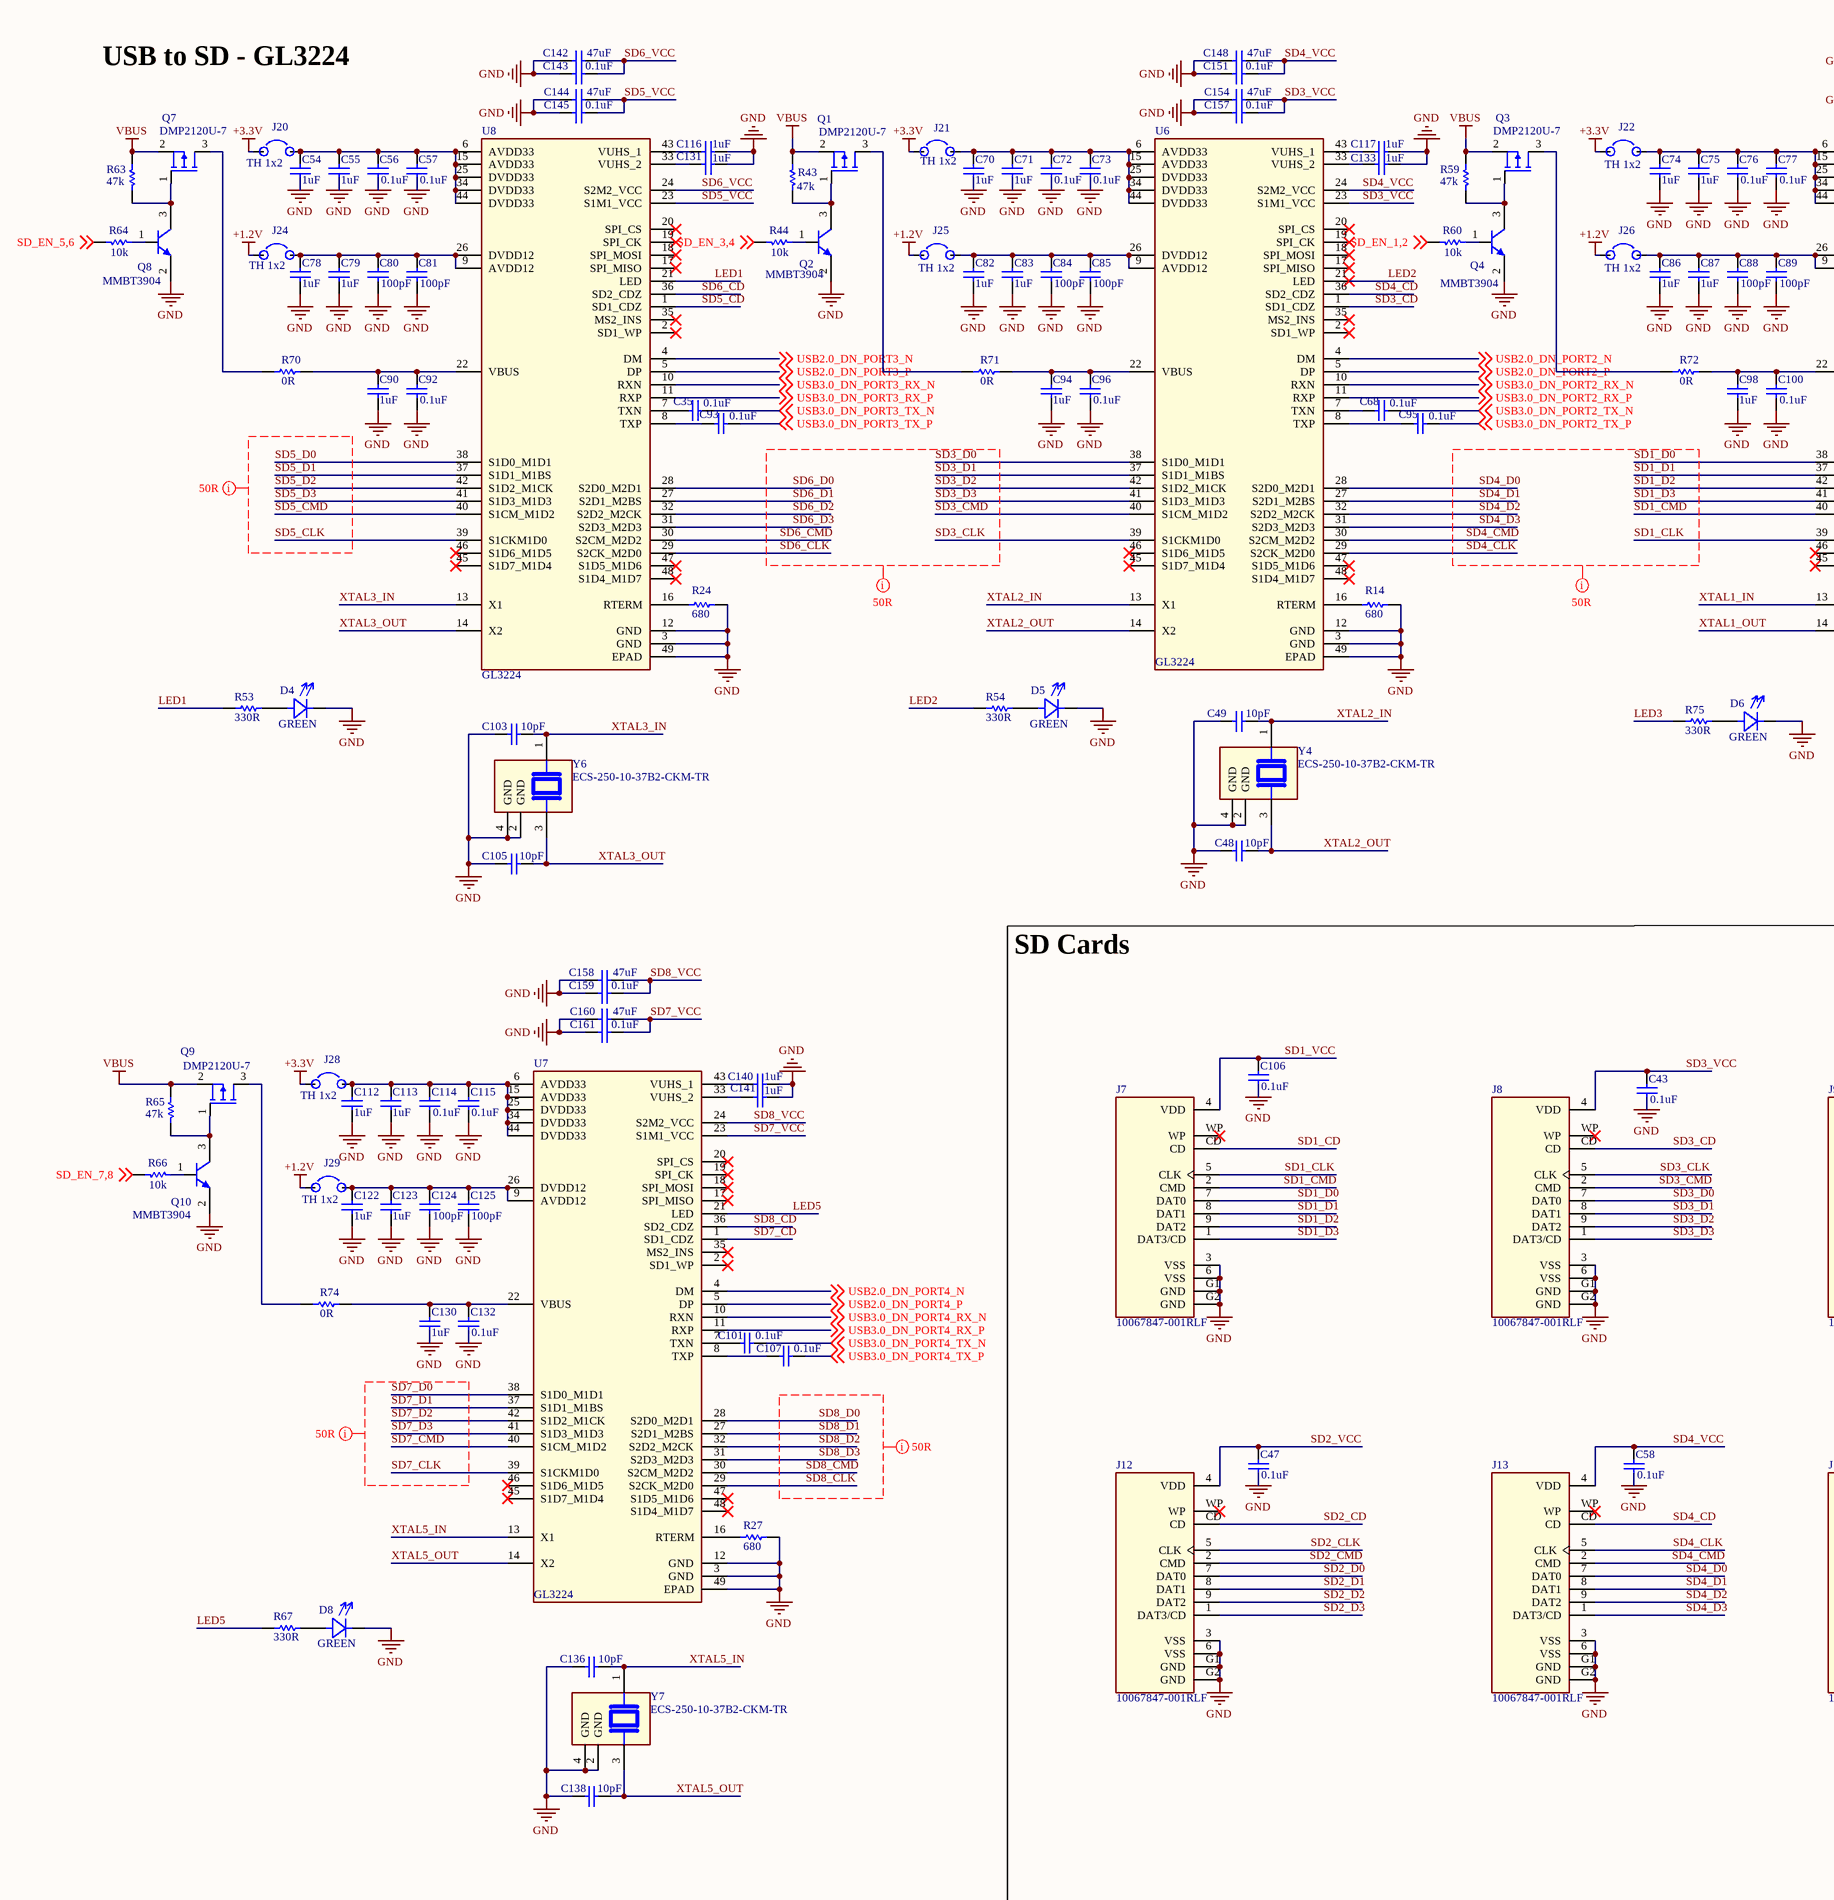
[diagram p2: 10X SD CARD READER SCH SHEET 3.SchDoc, left]
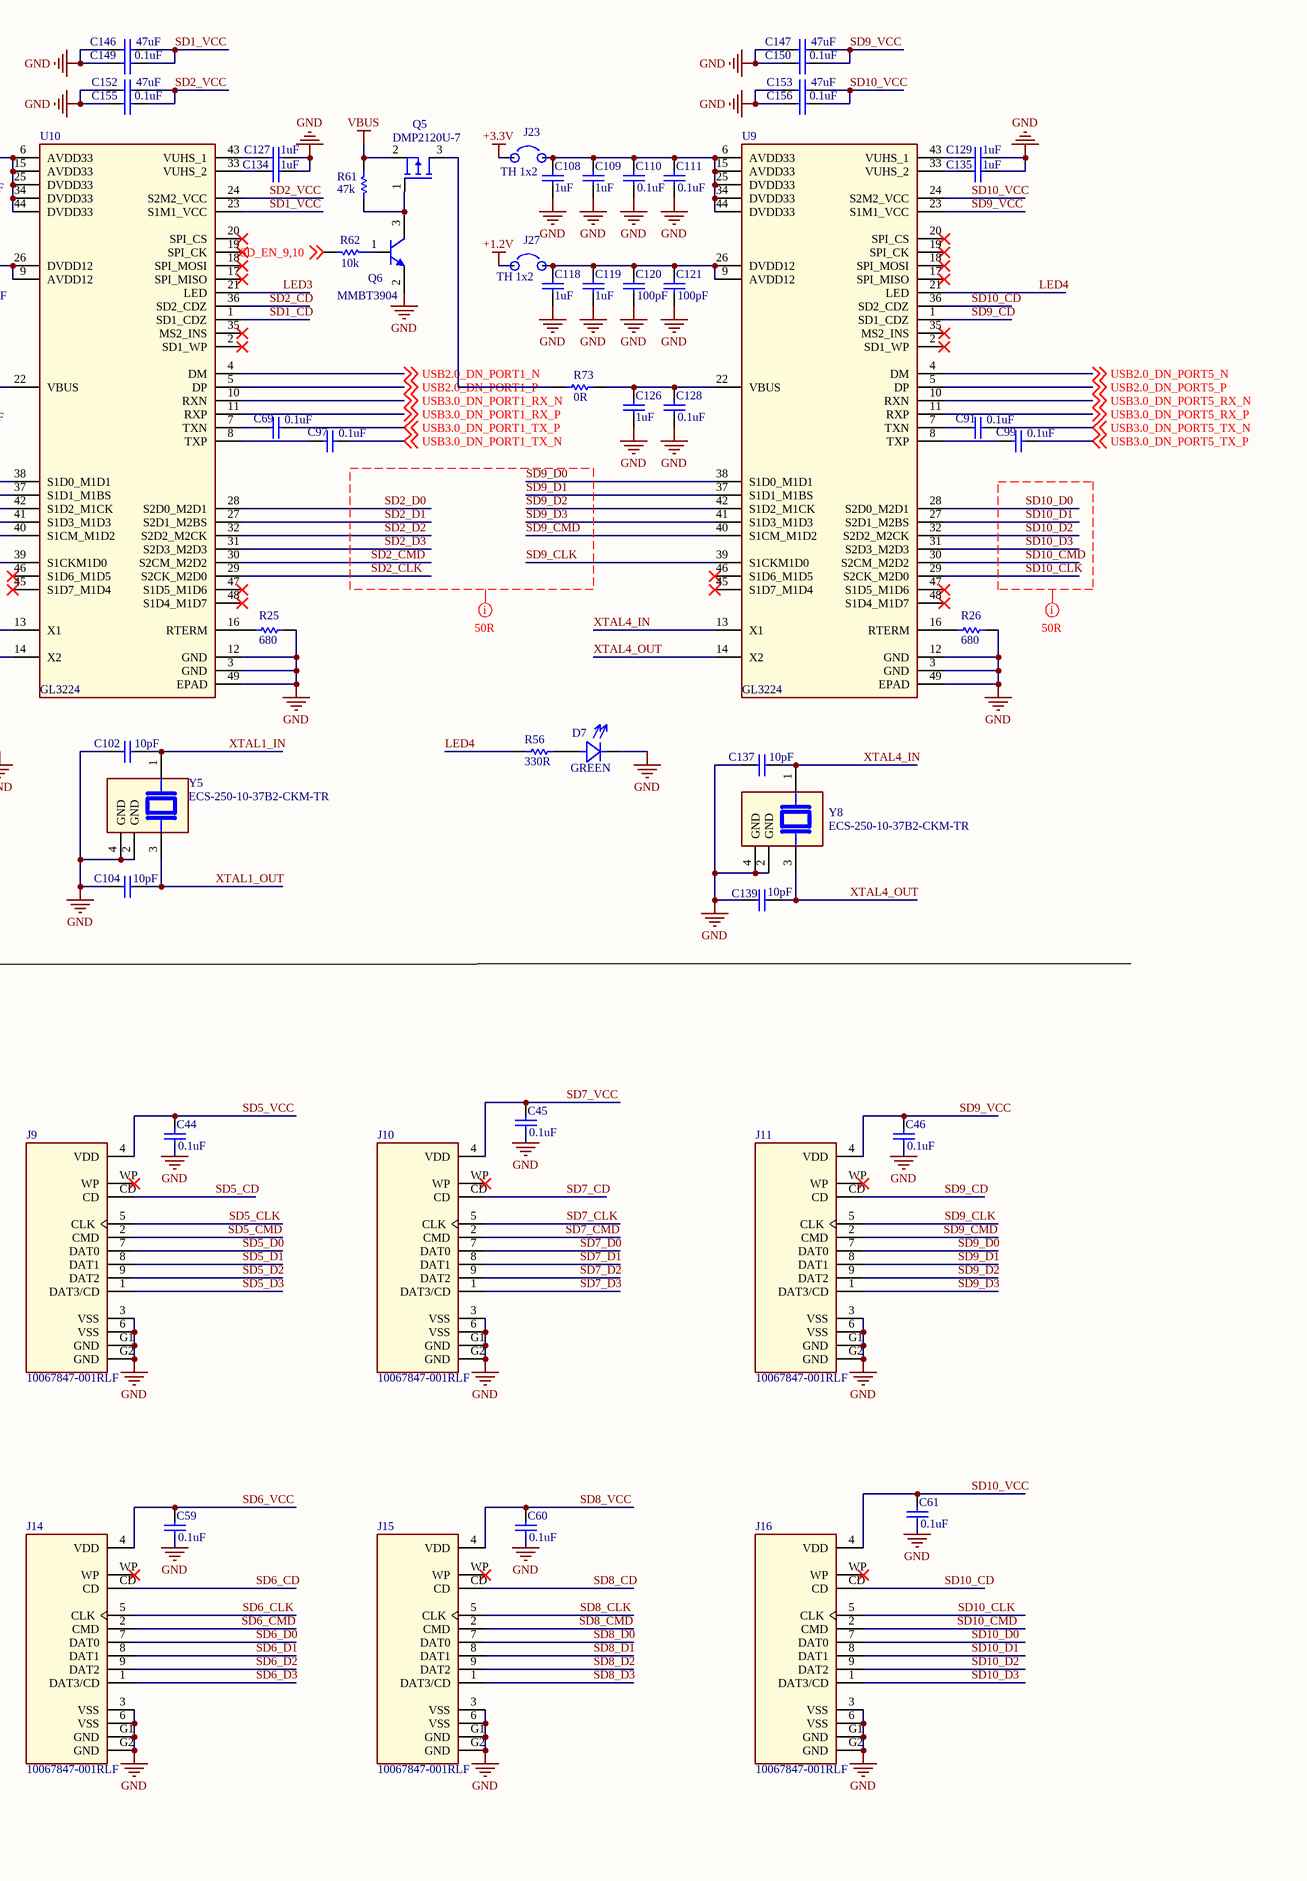
[diagram p3: 10X SD CARD READER SCH SHEET 3.SchDoc, right]

### Parts
C35  0.1uF  [C-0402/1005]
C43  0.1uF  [C-0402/1005]
C44  0.1uF  [C-0402/1005]
C45  0.1uF  [C-0402/1005]
C46  0.1uF  [C-0402/1005]
C47  0.1uF  [C-0402/1005]
C48  10pF  [C-0402/1005]
C49  10pF  [C-0402/1005]
C54  1uF  [C-0402/1005]
C55  1uF  [C-0402/1005]
C56  0.1uF  [C-0402/1005]
C57  0.1uF  [C-0402/1005]
C58  0.1uF  [C-0402/1005]
C59  0.1uF  [C-0402/1005]
C60  0.1uF  [C-0402/1005]
C61  0.1uF  [C-0402/1005]
C68  0.1uF  [C-0402/1005]
C69  0.1uF  [C-0402/1005]
C70  1uF  [C-0402/1005]
C71  1uF  [C-0402/1005]
C72  0.1uF  [C-0402/1005]
C73  0.1uF  [C-0402/1005]
C74  1uF  [C-0402/1005]
C75  1uF  [C-0402/1005]
C76  0.1uF  [C-0402/1005]
C77  0.1uF  [C-0402/1005]
C78  1uF  [C-0402/1005]
C79  1uF  [C-0402/1005]
C80  value 100pF  [C-0402/1005]  (hidden comment: 0.1uF)
C81  value 100pF  [C-0402/1005]  (hidden comment: 0.1uF)
C82  1uF  [C-0402/1005]
C83  1uF  [C-0402/1005]
C84  value 100pF  [C-0402/1005]  (hidden comment: 0.1uF)
C85  value 100pF  [C-0402/1005]  (hidden comment: 0.1uF)
C86  1uF  [C-0402/1005]
C87  1uF  [C-0402/1005]
C88  value 100pF  [C-0402/1005]  (hidden comment: 0.1uF)
C89  value 100pF  [C-0402/1005]  (hidden comment: 0.1uF)
C90  1uF  [C-0402/1005]
C91  0.1uF  [C-0402/1005]
C92  0.1uF  [C-0402/1005]
C93  0.1uF  [C-0402/1005]
C94  1uF  [C-0402/1005]
C95  0.1uF  [C-0402/1005]
C96  0.1uF  [C-0402/1005]
C97  0.1uF  [C-0402/1005]
C98  1uF  [C-0402/1005]
C99  0.1uF  [C-0402/1005]
C100  0.1uF  [C-0402/1005]
C101  0.1uF  [C-0402/1005]
C102  10pF  [C-0402/1005]
C103  10pF  [C-0402/1005]
C104  10pF  [C-0402/1005]
C105  10pF  [C-0402/1005]
C106  0.1uF  [C-0402/1005]
C107  0.1uF  [C-0402/1005]
C108  1uF  [C-0402/1005]
C109  1uF  [C-0402/1005]
C110  0.1uF  [C-0402/1005]
C111  0.1uF  [C-0402/1005]
C112  1uF  [C-0402/1005]
C113  1uF  [C-0402/1005]
C114  0.1uF  [C-0402/1005]
C115  0.1uF  [C-0402/1005]
C116  1uF  [C-0402/1005]
C117  1uF  [C-0402/1005]
C118  1uF  [C-0402/1005]
C119  1uF  [C-0402/1005]
C120  value 100pF  [C-0402/1005]  (hidden comment: 0.1uF)
C121  value 100pF  [C-0402/1005]  (hidden comment: 0.1uF)
C122  1uF  [C-0402/1005]
C123  1uF  [C-0402/1005]
C124  value 100pF  [C-0402/1005]  (hidden comment: 0.1uF)
C125  value 100pF  [C-0402/1005]  (hidden comment: 0.1uF)
C126  1uF  [C-0402/1005]
C127  1uF  [C-0402/1005]
C128  0.1uF  [C-0402/1005]
C129  1uF  [C-0402/1005]
C130  1uF  [C-0402/1005]
C131  1uF  [C-0402/1005]
C132  0.1uF  [C-0402/1005]
C133  1uF  [C-0402/1005]
C134  1uF  [C-0402/1005]
C135  1uF  [C-0402/1005]
C136  10pF  [C-0402/1005]
C137  10pF  [C-0402/1005]
C138  10pF  [C-0402/1005]
C139  10pF  [C-0402/1005]
C140  1uF  [C-0402/1005]
C141  1uF  [C-0402/1005]
C142  value 47uF  [C-0603/1608]  (hidden comment: 0.1uF)
C143  0.1uF  [C-0402/1005]
C144  value 47uF  [C-0603/1608]  (hidden comment: 0.1uF)
C145  0.1uF  [C-0402/1005]
C146  value 47uF  [C-0603/1608]  (hidden comment: 0.1uF)
C147  value 47uF  [C-0603/1608]  (hidden comment: 0.1uF)
C148  value 47uF  [C-0603/1608]  (hidden comment: 0.1uF)
C149  0.1uF  [C-0402/1005]
C150  0.1uF  [C-0402/1005]
C151  0.1uF  [C-0402/1005]
C152  value 47uF  [C-0603/1608]  (hidden comment: 0.1uF)
C153  value 47uF  [C-0603/1608]  (hidden comment: 0.1uF)
C154  value 47uF  [C-0603/1608]  (hidden comment: 0.1uF)
C155  0.1uF  [C-0402/1005]
C156  0.1uF  [C-0402/1005]
C157  0.1uF  [C-0402/1005]
C158  value 47uF  [C-0603/1608]  (hidden comment: 0.1uF)
C159  0.1uF  [C-0402/1005]
C160  value 47uF  [C-0603/1608]  (hidden comment: 0.1uF)
C161  0.1uF  [C-0402/1005]
D4  GREEN  [LEDC1608X65N]
D5  GREEN  [LEDC1608X65N]
D6  GREEN  [LEDC1608X65N]
D7  GREEN  [LEDC1608X65N]
D8  GREEN  [LEDC1608X65N]
J7  10067847-001RLF  [AMPHENOL_10067847-011RLF]
J8  10067847-001RLF  [AMPHENOL_10067847-011RLF]
J9  10067847-001RLF  [AMPHENOL_10067847-011RLF]
J10  10067847-001RLF  [AMPHENOL_10067847-011RLF]
J11  10067847-001RLF  [AMPHENOL_10067847-011RLF]
J12  10067847-001RLF  [AMPHENOL_10067847-011RLF]
J13  10067847-001RLF  [AMPHENOL_10067847-011RLF]
J14  10067847-001RLF  [AMPHENOL_10067847-011RLF]
J15  10067847-001RLF  [AMPHENOL_10067847-011RLF]
J16  10067847-001RLF  [AMPHENOL_10067847-011RLF]
J20  TH 1x2  [PIN HEADER 1x2 2.54mm]
J21  TH 1x2  [PIN HEADER 1x2 2.54mm]
J22  TH 1x2  [PIN HEADER 1x2 2.54mm]
J23  TH 1x2  [PIN HEADER 1x2 2.54mm]
J24  TH 1x2  [PIN HEADER 1x2 2.54mm]
J25  TH 1x2  [PIN HEADER 1x2 2.54mm]
J26  TH 1x2  [PIN HEADER 1x2 2.54mm]
J27  TH 1x2  [PIN HEADER 1x2 2.54mm]
J28  TH 1x2  [PIN HEADER 1x2 2.54mm]
J29  TH 1x2  [PIN HEADER 1x2 2.54mm]
Q1  DMP2120U-7  [SOT-23-3]
Q2  MMBT3904  [SOT-23-3]
Q3  DMP2120U-7  [SOT-23-3]
Q4  MMBT3904  [SOT-23-3]
Q5  DMP2120U-7  [SOT-23-3]
Q6  MMBT3904  [SOT-23-3]
Q7  DMP2120U-7  [SOT-23-3]
Q8  MMBT3904  [SOT-23-3]
Q9  DMP2120U-7  [SOT-23-3]
Q10  MMBT3904  [SOT-23-3]
R14  680  [R-0402/1005]
R24  680  [R-0402/1005]
R25  680  [R-0402/1005]
R26  680  [R-0402/1005]
R27  680  [R-0402/1005]
R43  47k  [R-0402/1005]
R44  10k  [R-0402/1005]
R53  330R  [R-0402/1005]
R54  330R  [R-0402/1005]
R56  330R  [R-0402/1005]
R59  47k  [R-0402/1005]
R60  10k  [R-0402/1005]
R61  47k  [R-0402/1005]
R62  10k  [R-0402/1005]
R63  47k  [R-0402/1005]
R64  10k  [R-0402/1005]
R65  47k  [R-0402/1005]
R66  10k  [R-0402/1005]
R67  330R  [R-0402/1005]
R70  0R  [R-0603/1608]
R71  0R  [R-0603/1608]
R72  0R  [R-0603/1608]
R73  0R  [R-0603/1608]
R74  0R  [R-0603/1608]
R75  330R  [R-0402/1005]
U6  GL3224  [GL3224]
U7  GL3224  [GL3224]
U8  GL3224  [GL3224]
U9  GL3224  [GL3224]
U10  GL3224  [GL3224]
Y4  ECS-250-10-37B2-CKM-TR  [ECS-250-10-37B2]
Y5  ECS-250-10-37B2-CKM-TR  [ECS-250-10-37B2]
Y6  ECS-250-10-37B2-CKM-TR  [ECS-250-10-37B2]
Y7  ECS-250-10-37B2-CKM-TR  [ECS-250-10-37B2]
Y8  ECS-250-10-37B2-CKM-TR  [ECS-250-10-37B2]

### Nets
+1.2V: J24.1 J25.1 J26.1 J27.1 J29.1
+3.3V: J20.1 J21.1 J22.1 J23.1 J28.1
GND: C43.1 C44.1 C45.1 C46.1 C47.1 C48.2 C49.2 C54.1 C55.1 C56.1 C57.1 C58.1 C59.1 C60.1 C61.1 C70.1 C71.1 C72.1 C73.1 C74.1 C75.1 C76.1 C77.1 C78.1 C79.1 C80.1 C81.1 C82.1 C83.1 C84.1 C85.1 C86.1 C87.1 C88.1 C89.1 C90.1 C92.1 C94.1 C96.1 C98.1 C100.1 C102.2 C103.2 C104.2 C105.2 C106.1 C108.1 C109.1 C110.1 C111.1 C112.1 C113.1 C114.1 C115.1 C116.1 C117.1 C118.1 C119.1 C120.1 C121.1 C122.1 C123.1 C124.1 C125.1 C126.1 C127.1 C128.1 C129.1 C130.1 C131.1 C132.1 C133.1 C134.1 C135.1 C136.2 C137.2 C138.2 C139.2 C140.1 C141.1 C142.1 C143.1 C144.1 C145.1 C146.1 C147.1 C148.1 C149.1 C150.1 C151.1 C152.1 C153.1 C154.1 C155.1 C156.1 C157.1 C158.1 C159.1 C160.1 C161.1 D4.C D5.C D6.C D7.C D8.C J7.3(VSS) J7.6(VSS) J7.G1(GND) J7.G2(GND) J8.3(VSS) J8.6(VSS) J8.G1(GND) J8.G2(GND) J9.3(VSS) J9.6(VSS) J9.G1(GND) J9.G2(GND) J10.3(VSS) J10.6(VSS) J10.G1(GND) J10.G2(GND) J11.3(VSS) J11.6(VSS) J11.G1(GND) J11.G2(GND) J12.3(VSS) J12.6(VSS) J12.G1(GND) J12.G2(GND) J13.3(VSS) J13.6(VSS) J13.G1(GND) J13.G2(GND) J14.3(VSS) J14.6(VSS) J14.G1(GND) J14.G2(GND) J15.3(VSS) J15.6(VSS) J15.G1(GND) J15.G2(GND) J16.3(VSS) J16.6(VSS) J16.G1(GND) J16.G2(GND) Q2.2(E) Q4.2(E) Q6.2(E) Q8.2(E) Q10.2(E) R14.1 R24.1 R25.1 R26.1 R27.1 U6.3(GND) U6.12(GND) U6.49(EPAD) U7.3(GND) U7.12(GND) U7.49(EPAD) U8.3(GND) U8.12(GND) U8.49(EPAD) U9.3(GND) U9.12(GND) U9.49(EPAD) U10.3(GND) U10.12(GND) U10.49(EPAD) Y4.2(GND) Y4.4(GND) Y5.2(GND) Y5.4(GND) Y6.2(GND) Y6.4(GND) Y7.2(GND) Y7.4(GND) Y8.2(GND) Y8.4(GND)
VBUS: Q1.2 Q3.2 Q5.2 Q7.2 Q9.2 R43.1 R59.1 R61.1 R63.1 R65.1
LED1: R53.2 U8.21(LED)
LED2: R54.2 U6.21(LED)
LED3: R75.2 U10.21(LED)
LED4: R56.2 U9.21(LED)
LED5: R67.2 U7.21(LED)
SD1_CD: J7.CD U10.1(SD1_CDZ)
SD1_CLK: J7.5(CLK) U10.39(S1CKM1D0)
SD1_CMD: J7.2(CMD) U10.40(S1CM_M1D2)
SD1_D0: J7.7(DAT0) U10.38(S1D0_M1D1)
SD1_D1: J7.8(DAT1) U10.37(S1D1_M1BS)
SD1_D2: J7.9(DAT2) U10.42(S1D2_M1CK)
SD1_D3: J7.1(DAT3/CD) U10.41(S1D3_M1D3)
SD1_VCC: C106.2 C146.2 C149.2 J7.4(VDD) U10.23(S1M1_VCC)
SD2_CD: J12.CD U10.36(SD2_CDZ)
SD2_CLK: J12.5(CLK) U10.29(S2CK_M2D0)
SD2_CMD: J12.2(CMD) U10.30(S2CM_M2D2)
SD2_D0: J12.7(DAT0) U10.28(S2D0_M2D1)
SD2_D1: J12.8(DAT1) U10.27(S2D1_M2BS)
SD2_D2: J12.9(DAT2) U10.32(S2D2_M2CK)
SD2_D3: J12.1(DAT3/CD) U10.31(S2D3_M2D3)
SD2_VCC: C47.2 C152.2 C155.2 J12.4(VDD) U10.24(S2M2_VCC)
SD3_CD: J8.CD U6.1(SD1_CDZ)
SD3_CLK: J8.5(CLK) U6.39(S1CKM1D0)
SD3_CMD: J8.2(CMD) U6.40(S1CM_M1D2)
SD3_D0: J8.7(DAT0) U6.38(S1D0_M1D1)
SD3_D1: J8.8(DAT1) U6.37(S1D1_M1BS)
SD3_D2: J8.9(DAT2) U6.42(S1D2_M1CK)
SD3_D3: J8.1(DAT3/CD) U6.41(S1D3_M1D3)
SD3_VCC: C43.2 C154.2 C157.2 J8.4(VDD) U6.23(S1M1_VCC)
SD4_CD: J13.CD U6.36(SD2_CDZ)
SD4_CLK: J13.5(CLK) U6.29(S2CK_M2D0)
SD4_CMD: J13.2(CMD) U6.30(S2CM_M2D2)
SD4_D0: J13.7(DAT0) U6.28(S2D0_M2D1)
SD4_D1: J13.8(DAT1) U6.27(S2D1_M2BS)
SD4_D2: J13.9(DAT2) U6.32(S2D2_M2CK)
SD4_D3: J13.1(DAT3/CD) U6.31(S2D3_M2D3)
SD4_VCC: C58.2 C148.2 C151.2 J13.4(VDD) U6.24(S2M2_VCC)
SD5_CD: J9.CD U8.1(SD1_CDZ)
SD5_CLK: J9.5(CLK) U8.39(S1CKM1D0)
SD5_CMD: J9.2(CMD) U8.40(S1CM_M1D2)
SD5_D0: J9.7(DAT0) U8.38(S1D0_M1D1)
SD5_D1: J9.8(DAT1) U8.37(S1D1_M1BS)
SD5_D2: J9.9(DAT2) U8.42(S1D2_M1CK)
SD5_D3: J9.1(DAT3/CD) U8.41(S1D3_M1D3)
SD5_VCC: C44.2 C144.2 C145.2 J9.4(VDD) U8.23(S1M1_VCC)
SD6_CD: J14.CD U8.36(SD2_CDZ)
SD6_CLK: J14.5(CLK) U8.29(S2CK_M2D0)
SD6_CMD: J14.2(CMD) U8.30(S2CM_M2D2)
SD6_D0: J14.7(DAT0) U8.28(S2D0_M2D1)
SD6_D1: J14.8(DAT1) U8.27(S2D1_M2BS)
SD6_D2: J14.9(DAT2) U8.32(S2D2_M2CK)
SD6_D3: J14.1(DAT3/CD) U8.31(S2D3_M2D3)
SD6_VCC: C59.2 C142.2 C143.2 J14.4(VDD) U8.24(S2M2_VCC)
SD7_CD: J10.CD U7.1(SD1_CDZ)
SD7_CLK: J10.5(CLK) U7.39(S1CKM1D0)
SD7_CMD: J10.2(CMD) U7.40(S1CM_M1D2)
SD7_D0: J10.7(DAT0) U7.38(S1D0_M1D1)
SD7_D1: J10.8(DAT1) U7.37(S1D1_M1BS)
SD7_D2: J10.9(DAT2) U7.42(S1D2_M1CK)
SD7_D3: J10.1(DAT3/CD) U7.41(S1D3_M1D3)
SD7_VCC: C45.2 C160.2 C161.2 J10.4(VDD) U7.23(S1M1_VCC)
SD8_CD: J15.CD U7.36(SD2_CDZ)
SD8_CLK: J15.5(CLK) U7.29(S2CK_M2D0)
SD8_CMD: J15.2(CMD) U7.30(S2CM_M2D2)
SD8_D0: J15.7(DAT0) U7.28(S2D0_M2D1)
SD8_D1: J15.8(DAT1) U7.27(S2D1_M2BS)
SD8_D2: J15.9(DAT2) U7.32(S2D2_M2CK)
SD8_D3: J15.1(DAT3/CD) U7.31(S2D3_M2D3)
SD8_VCC: C60.2 C158.2 C159.2 J15.4(VDD) U7.24(S2M2_VCC)
SD9_CD: J11.CD U9.1(SD1_CDZ)
SD9_CLK: J11.5(CLK) U9.39(S1CKM1D0)
SD9_CMD: J11.2(CMD) U9.40(S1CM_M1D2)
SD9_D0: J11.7(DAT0) U9.38(S1D0_M1D1)
SD9_D1: J11.8(DAT1) U9.37(S1D1_M1BS)
SD9_D2: J11.9(DAT2) U9.42(S1D2_M1CK)
SD9_D3: J11.1(DAT3/CD) U9.41(S1D3_M1D3)
SD9_VCC: C46.2 C147.2 C150.2 J11.4(VDD) U9.23(S1M1_VCC)
SD10_CD: J16.CD U9.36(SD2_CDZ)
SD10_CLK: J16.5(CLK) U9.29(S2CK_M2D0)
SD10_CMD: J16.2(CMD) U9.30(S2CM_M2D2)
SD10_D0: J16.7(DAT0) U9.28(S2D0_M2D1)
SD10_D1: J16.8(DAT1) U9.27(S2D1_M2BS)
SD10_D2: J16.9(DAT2) U9.32(S2D2_M2CK)
SD10_D3: J16.1(DAT3/CD) U9.31(S2D3_M2D3)
SD10_VCC: C61.2 C153.2 C156.2 J16.4(VDD) U9.24(S2M2_VCC)
SD_EN_1,2: R60.1 ; off-sheet SD_EN_1,2  [project net SD1]
SD_EN_3,4: R44.1 ; off-sheet SD_EN_3,4  [project net SD2]
SD_EN_5,6: R64.1 ; off-sheet SD_EN_5,6  [project net SD3]
SD_EN_7,8: R66.1 ; off-sheet SD_EN_7,8  [project net SD4]
SD_EN_9,10: R62.1 ; off-sheet SD_EN_9,10  [project net SD5]
USB2.0_DN_PORT1_N: U10.4(DM) ; off-sheet USB2.0_DN_PORT1_N
USB2.0_DN_PORT1_P: U10.5(DP) ; off-sheet USB2.0_DN_PORT1_P
USB2.0_DN_PORT2_N: U6.4(DM) ; off-sheet USB2.0_DN_PORT2_N
USB2.0_DN_PORT2_P: U6.5(DP) ; off-sheet USB2.0_DN_PORT2_P
USB2.0_DN_PORT3_N: U8.4(DM) ; off-sheet USB2.0_DN_PORT3_N
USB2.0_DN_PORT3_P: U8.5(DP) ; off-sheet USB2.0_DN_PORT3_P
USB2.0_DN_PORT4_N: U7.4(DM) ; off-sheet USB2.0_DN_PORT4_N
USB2.0_DN_PORT4_P: U7.5(DP) ; off-sheet USB2.0_DN_PORT4_P
USB2.0_DN_PORT5_N: U9.4(DM) ; off-sheet USB2.0_DN_PORT5_N
USB2.0_DN_PORT5_P: U9.5(DP) ; off-sheet USB2.0_DN_PORT5_P
USB3.0_DN_PORT1_RX_N: U10.10(RXN) ; off-sheet USB3.0_DN_PORT1_RX_N
USB3.0_DN_PORT1_RX_P: U10.11(RXP) ; off-sheet USB3.0_DN_PORT1_RX_P
USB3.0_DN_PORT1_TX_N: C97.1 ; off-sheet USB3.0_DN_PORT1_TX_N
USB3.0_DN_PORT1_TX_P: C69.1 ; off-sheet USB3.0_DN_PORT1_TX_P
USB3.0_DN_PORT2_RX_N: U6.10(RXN) ; off-sheet USB3.0_DN_PORT2_RX_N
USB3.0_DN_PORT2_RX_P: U6.11(RXP) ; off-sheet USB3.0_DN_PORT2_RX_P
USB3.0_DN_PORT2_TX_N: C68.1 ; off-sheet USB3.0_DN_PORT2_TX_N
USB3.0_DN_PORT2_TX_P: C95.1 ; off-sheet USB3.0_DN_PORT2_TX_P
USB3.0_DN_PORT3_RX_N: U8.10(RXN) ; off-sheet USB3.0_DN_PORT3_RX_N
USB3.0_DN_PORT3_RX_P: U8.11(RXP) ; off-sheet USB3.0_DN_PORT3_RX_P
USB3.0_DN_PORT3_TX_N: C35.1 ; off-sheet USB3.0_DN_PORT3_TX_N
USB3.0_DN_PORT3_TX_P: C93.1 ; off-sheet USB3.0_DN_PORT3_TX_P
USB3.0_DN_PORT4_RX_N: U7.10(RXN) ; off-sheet USB3.0_DN_PORT4_RX_N
USB3.0_DN_PORT4_RX_P: U7.11(RXP) ; off-sheet USB3.0_DN_PORT4_RX_P
USB3.0_DN_PORT4_TX_N: C101.1 ; off-sheet USB3.0_DN_PORT4_TX_N
USB3.0_DN_PORT4_TX_P: C107.1 ; off-sheet USB3.0_DN_PORT4_TX_P
USB3.0_DN_PORT5_RX_N: U9.10(RXN) ; off-sheet USB3.0_DN_PORT5_RX_N
USB3.0_DN_PORT5_RX_P: U9.11(RXP) ; off-sheet USB3.0_DN_PORT5_RX_P
USB3.0_DN_PORT5_TX_N: C91.1 ; off-sheet USB3.0_DN_PORT5_TX_N
USB3.0_DN_PORT5_TX_P: C99.1 ; off-sheet USB3.0_DN_PORT5_TX_P
XTAL1_IN: C102.1 U10.13(X1) Y5.1
XTAL1_OUT: C104.1 U10.14(X2) Y5.3
XTAL2_IN: C49.1 U6.13(X1) Y4.1
XTAL2_OUT: C48.1 U6.14(X2) Y4.3
XTAL3_IN: C103.1 U8.13(X1) Y6.1
XTAL3_OUT: C105.1 U8.14(X2) Y6.3
XTAL4_IN: C137.1 U9.13(X1) Y8.1
XTAL4_OUT: C139.1 U9.14(X2) Y8.3
XTAL5_IN: C136.1 U7.13(X1) Y7.1
XTAL5_OUT: C138.1 U7.14(X2) Y7.3
NetC35_2: C35.2 U8.7(TXN)
NetC54_2: C54.2 C55.2 C56.2 C57.2 J20.2 U8.6(AVDD33) U8.15(AVDD33) U8.25(DVDD33) U8.34(DVDD33) U8.44(DVDD33)
NetC68_2: C68.2 U6.7(TXN)
NetC69_2: C69.2 U10.7(TXN)
NetC70_2: C70.2 C71.2 C72.2 C73.2 J21.2 U6.6(AVDD33) U6.15(AVDD33) U6.25(DVDD33) U6.34(DVDD33) U6.44(DVDD33)
NetC74_2: C74.2 C75.2 C76.2 C77.2 J22.2 U10.6(AVDD33) U10.15(AVDD33) U10.25(DVDD33) U10.34(DVDD33) U10.44(DVDD33)
NetC78_2: C78.2 C79.2 C80.2 C81.2 J24.2 U8.9(AVDD12) U8.26(DVDD12)
NetC82_2: C82.2 C83.2 C84.2 C85.2 J25.2 U6.9(AVDD12) U6.26(DVDD12)
NetC86_2: C86.2 C87.2 C88.2 C89.2 J26.2 U10.9(AVDD12) U10.26(DVDD12)
NetC90_2: C90.2 C92.2 R70.2 U8.22(VBUS)
NetC91_2: C91.2 U9.7(TXN)
NetC93_2: C93.2 U8.8(TXP)
NetC94_2: C94.2 C96.2 R71.2 U6.22(VBUS)
NetC95_2: C95.2 U6.8(TXP)
NetC97_2: C97.2 U10.8(TXP)
NetC98_2: C98.2 C100.2 R72.2 U10.22(VBUS)
NetC99_2: C99.2 U9.8(TXP)
NetC101_2: C101.2 U7.7(TXN)
NetC107_2: C107.2 U7.8(TXP)
NetC108_2: C108.2 C109.2 C110.2 C111.2 J23.2 U9.6(AVDD33) U9.15(AVDD33) U9.25(DVDD33) U9.34(DVDD33) U9.44(DVDD33)
NetC112_2: C112.2 C113.2 C114.2 C115.2 J28.2 U7.6(AVDD33) U7.15(AVDD33) U7.25(DVDD33) U7.34(DVDD33) U7.44(DVDD33)
NetC116_2: C116.2 U8.43(VUHS_1)
NetC117_2: C117.2 U6.43(VUHS_1)
NetC118_2: C118.2 C119.2 C120.2 C121.2 J27.2 U9.9(AVDD12) U9.26(DVDD12)
NetC122_2: C122.2 C123.2 C124.2 C125.2 J29.2 U7.9(AVDD12) U7.26(DVDD12)
NetC126_2: C126.2 C128.2 R73.2 U9.22(VBUS)
NetC127_2: C127.2 U10.43(VUHS_1)
NetC129_2: C129.2 U9.43(VUHS_1)
NetC130_2: C130.2 C132.2 R74.2 U7.22(VBUS)
NetC131_2: C131.2 U8.33(VUHS_2)
NetC133_2: C133.2 U6.33(VUHS_2)
NetC134_2: C134.2 U10.33(VUHS_2)
NetC135_2: C135.2 U9.33(VUHS_2)
NetC140_2: C140.2 U7.43(VUHS_1)
NetC141_2: C141.2 U7.33(VUHS_2)
NetD4_A: D4.A R53.1
NetD5_A: D5.A R54.1
NetD6_A: D6.A R75.1
NetD7_A: D7.A R56.1
NetD8_A: D8.A R67.1
NetQ1_1: Q1.1 Q2.3(C) R43.2
NetQ1_3: Q1.3 R71.1
NetQ2_1: Q2.1(B) R44.2
NetQ3_1: Q3.1 Q4.3(C) R59.2
NetQ3_3: Q3.3 R72.1
NetQ4_1: Q4.1(B) R60.2
NetQ5_1: Q5.1 Q6.3(C) R61.2
NetQ5_3: Q5.3 R73.1
NetQ6_1: Q6.1(B) R62.2
NetQ7_1: Q7.1 Q8.3(C) R63.2
NetQ7_3: Q7.3 R70.1
NetQ8_1: Q8.1(B) R64.2
NetQ9_1: Q9.1 Q10.3(C) R65.2
NetQ9_3: Q9.3 R74.1
NetQ10_1: Q10.1(B) R66.2
NetR14_2: R14.2 U6.16(RTERM)
NetR24_2: R24.2 U8.16(RTERM)
NetR25_2: R25.2 U10.16(RTERM)
NetR26_2: R26.2 U9.16(RTERM)
NetR27_2: R27.2 U7.16(RTERM)

Not connected (* = marked no-connect by the designer): J7 WP*; J8 WP*; J9 WP*; J10 WP*; J11 WP*; J12 WP*; J13 WP*; J14 WP*; J15 WP*; J16 WP*; U6 2(SD1_WP)* 17(SPI_MISO)* 18(SPI_MOSI)* 19(SPI_CK)* 20(SPI_CS)* 35(MS2_INS)* 45(S1D7_M1D4)* 46(S1D6_M1D5)* 47(S1D5_M1D6)* 48(S1D4_M1D7)*; U7 2(SD1_WP)* 17(SPI_MISO)* 18(SPI_MOSI)* 19(SPI_CK)* 20(SPI_CS)* 35(MS2_INS)* 45(S1D7_M1D4)* 46(S1D6_M1D5)* 47(S1D5_M1D6)* 48(S1D4_M1D7)*; U8 2(SD1_WP)* 17(SPI_MISO)* 18(SPI_MOSI)* 19(SPI_CK)* 20(SPI_CS)* 35(MS2_INS)* 45(S1D7_M1D4)* 46(S1D6_M1D5)* 47(S1D5_M1D6)* 48(S1D4_M1D7)*; U9 2(SD1_WP)* 17(SPI_MISO)* 18(SPI_MOSI)* 19(SPI_CK)* 20(SPI_CS)* 35(MS2_INS)* 45(S1D7_M1D4)* 46(S1D6_M1D5)* 47(S1D5_M1D6)* 48(S1D4_M1D7)*; U10 2(SD1_WP)* 17(SPI_MISO)* 18(SPI_MOSI)* 19(SPI_CK)* 20(SPI_CS)* 35(MS2_INS)* 45(S1D7_M1D4)* 46(S1D6_M1D5)* 47(S1D5_M1D6)* 48(S1D4_M1D7)*

### Layout directives
net class 50R: SD1_CLK, SD1_CMD, SD1_D0, SD1_D1, SD1_D2, SD1_D3, SD2_CLK, SD2_CMD, SD2_D0, SD2_D1, SD2_D2, SD2_D3, SD3_CLK, SD3_CMD, SD3_D0, SD3_D1, SD3_D2, SD3_D3, SD4_CLK, SD4_CMD, SD4_D0, SD4_D1, SD4_D2, SD4_D3, SD5_CLK, SD5_CMD, SD5_D0, SD5_D1, SD5_D2, SD5_D3, SD6_CLK, SD6_CMD, SD6_D0, SD6_D1, SD6_D2, SD6_D3, SD7_CLK, SD7_CMD, SD7_D0, SD7_D1, SD7_D2, SD7_D3, SD8_CLK, SD8_CMD, SD8_D0, SD8_D1, SD8_D2, SD8_D3, SD9_CLK, SD9_CMD, SD9_D0, SD9_D1, SD9_D2, SD9_D3, SD10_CLK, SD10_CMD, SD10_D0, SD10_D1, SD10_D2, SD10_D3

### Notes on the sheet
- USB to SD - GL3224
- SD Cards
- Labels drawn without touching a wire or pin: \

### Library data of the parts
C35 C43-C47 C56-C61 C68 C69 C72 C73 C76 C77 C80 C81 C84 C85 C88 C89 C91-C93 C95-C97 C99-C101 C106 C107 C110 C111 C114 C115 C120 C121 C124 C125 C128 C132 C142-C161 = Cap: Capacitor; Published: 8-Jun-2000; LatestRevisionDate: 17-Jul-2002; LatestRevisionNote: Re-released for DXP Platform.; PackageReference: RAD-0.3; Publisher: Altium Limited; PackageDescription: Radial Cap, Thru-Hole; 2 Leads; 0.3 in Pin Spacing
  C35 C43-C47 C56-C61 C68 C69 C72 C73 C76 C77 C91-C93 C95-C97 C99-C101 C106 C107 C110 C111 C114 C115 C128 C132 C143 C145 C149-C151 C155-C157 C159 C161: Value: 0.1uF
C48 C49 C54 C55 C70 C71 C74 C75 C90 C94 C98 C102-C105 C108 C109 C112 C113 C126 C130 C136-C139 = Cap: Capacitor; Value: 0.1uF; Published: 8-Jun-2000; LatestRevisionDate: 17-Jul-2002; LatestRevisionNote: Re-released for DXP Platform.; PackageReference: RAD-0.3; Publisher: Altium Limited; PackageDescription: Radial Cap, Thru-Hole; 2 Leads; 0.3 in Pin Spacing
C78 C79 C82 C83 C86 C87 C116-C119 C122 C123 C127 C129 C131 C133-C135 C140 C141 = Cap: Capacitor; Value: 100pF; Published: 8-Jun-2000; LatestRevisionDate: 17-Jul-2002; LatestRevisionNote: Re-released for DXP Platform.; PackageReference: RAD-0.3; Publisher: Altium Limited; PackageDescription: Radial Cap, Thru-Hole; 2 Leads; 0.3 in Pin Spacing
D4-D8 = Diode-LED: Supplier: Digikey Electronics
J7-J16 = 10067847-001RLF: 12 (9 + 3) Position Card Connector Secure Digital - SD Surface Mount Gold; MF: Amphenol ICC; MP: 10067847-001RLF; Digi-Key_Part_Number: 609-3956-1-ND; Check_prices: https://www.snapeda.com/parts/10067847-001RLF/Amphenol%20FCI/view-part/1746378/?ref=eda; SnapEDA_Link: https://www.snapeda.com/parts/10067847-001RLF/Amphenol%20FCI/view-part/1746378/?ref=snap; Purchase-URL: https://pricing.snapeda.com/search/part/10067847-001RLF/?ref=eda; Package: None; Value: *
J20-J29 = Jumper 2 pin: as J17 on sheet 10X SD CARD READER SCH SHEET 2; Supplier Part No.: 609-75160-156-03LF-ND; Supplier: Digikey Electronics
Q1 Q3 Q5 Q7 Q9 = MOSFET-P: Supplier: Digikey Electronics
Q2 Q4 Q6 Q8 Q10 = MMBT3904: Manufacturer: Diodes Inc.; Man. PN: MMBT3904-7-F; Other: NPN. SOT23-3; Value: MMBT3904; Supplier: LCSC; Supplier PN: C94514
R14 R24-R27 R43 R53 R54 R56 R59 R61 R63 R65 R67 R75 = Res1: Resistor; Value: 10K; Published: 8-Jun-2000; LatestRevisionDate: 17-Jul-2002; LatestRevisionNote: Re-released for DXP Platform.; PackageReference: AXIAL-0.3; Publisher: Altium Limited; PackageDescription: Axial Device, Thru-Hole; 2 Leads; 0.3 in Pin Spacing
R44 R60 R62 R64 R66 = Res1: Resistor; Published: 8-Jun-2000; LatestRevisionDate: 17-Jul-2002; LatestRevisionNote: Re-released for DXP Platform.; PackageReference: AXIAL-0.3; Publisher: Altium Limited; PackageDescription: Axial Device, Thru-Hole; 2 Leads; 0.3 in Pin Spacing; Value: 10K
R70-R74 = Res1: Resistor; Value: 200K; Published: 8-Jun-2000; LatestRevisionDate: 17-Jul-2002; LatestRevisionNote: Re-released for DXP Platform.; PackageReference: AXIAL-0.3; Publisher: Altium Limited; PackageDescription: Axial Device, Thru-Hole; 2 Leads; 0.3 in Pin Spacing
U6-U10 = GL3224: MEMORY CARD READER CONTROLLER; Manufacturer: Genesys Logic Inc; Manufacturer Product Number: GL3224; Supplier: Quest Components; Unit Price: $15; Stock: 15

## Sheet 10X SD CARD READER SCH SHEET 4.SchDoc
size A3
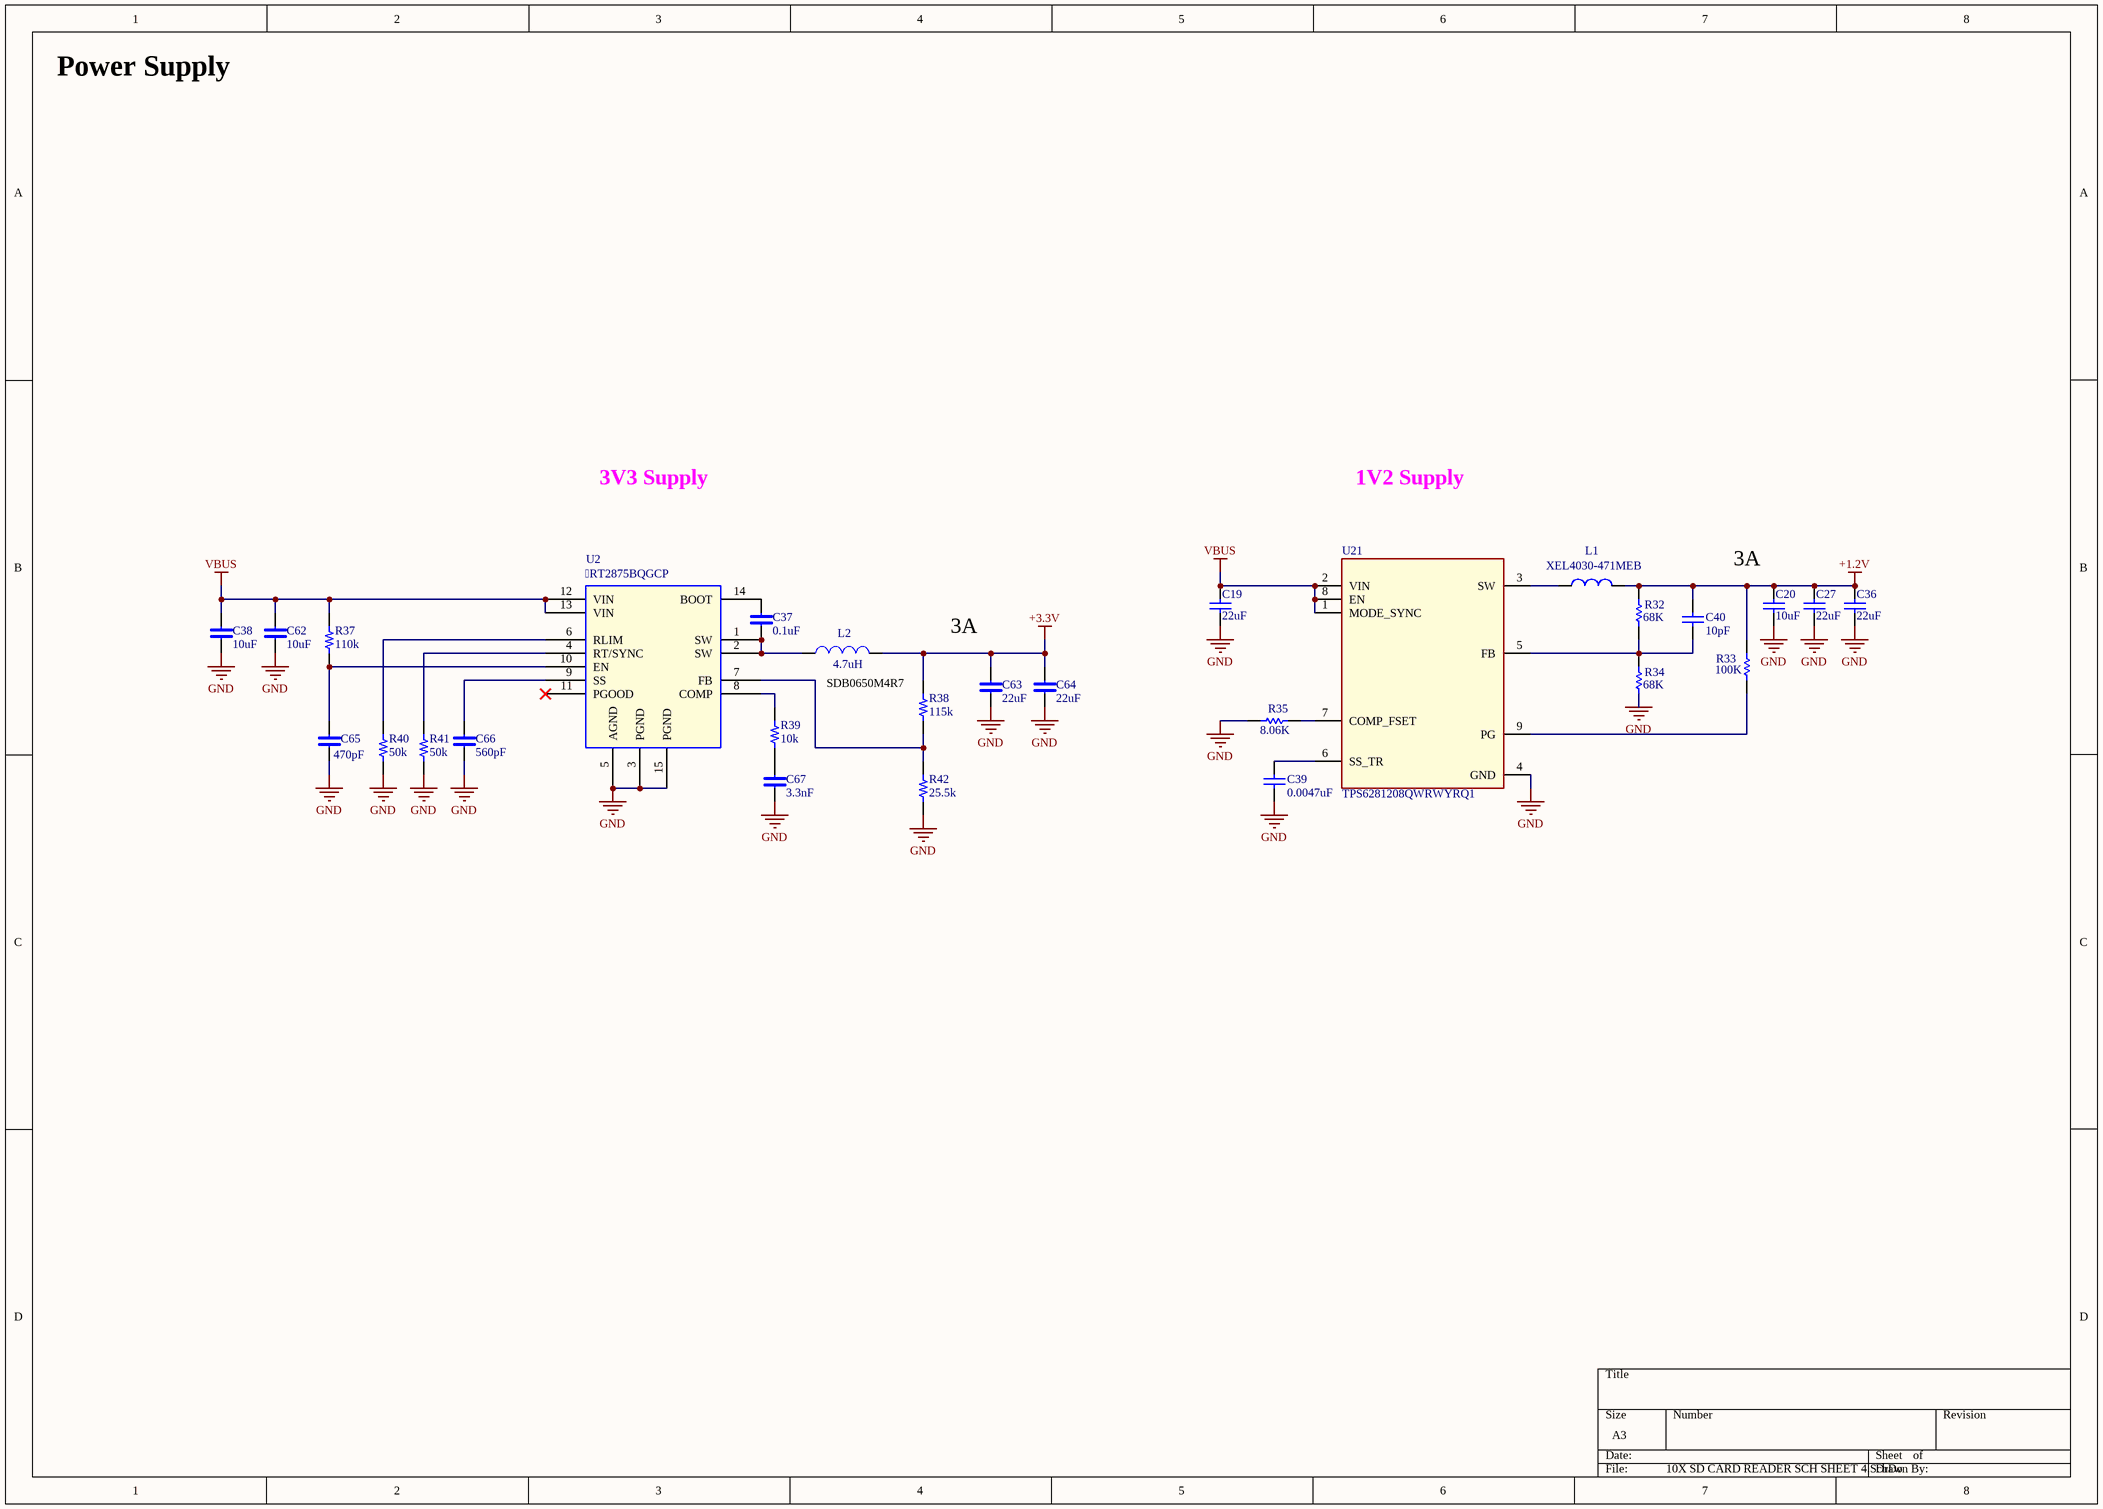
[diagram p4: 10X SD CARD READER SCH SHEET 4.SchDoc]

### Parts
C19  22uF  [CAPC3216X180N]
C20  10uF  [CAPC1608X100N]
C27  22uF  [CAPC3216X180N]
C36  22uF  [CAPC3216X180N]
C37  0.1uF  [C-0402/1005]
C38  10uF  [C-1206/3216]
C39  value 0.0047uF  [C-0402/1005]  (hidden comment: 0.1uF)
C40  value 10pF  [C-0402/1005]  (hidden comment: 0.1uF)
C62  10uF  [C-1206/3216]
C63  22uF  [C-1206/3216]
C64  22uF  [C-1206/3216]
C65  470pF  [C-0402/1005]
C66  560pF  [C-0402/1005]
C67  3.3nF  [C-0402/1005]
L1  XEL4030-471MEB  [IND_XEL4030_3.1_COC]
L2  4.7uH  [IND_SPM6550T-4R7M]
R32  68K  [R-0402/1005]
R33  100K  [R-0402/1005]
R34  68K  [R-0402/1005]
R35  8.06K  [R-0402/1005]
R37  110k  [R-0402/1005]
R38  115k  [R-0402/1005]
R39  10k  [R-0402/1005]
R40  50k  [R-0402/1005]
R41  50k  [R-0402/1005]
R42  25.5k  [R-0402/1005]
U2  RT2875BQGCP  [TSSOP-14]
U21  TPS6281208QWRWYRQ1  [RWY0009A]

### Nets
+1.2V: C20.2 C27.2 C36.2 C40.1 L1.2 R32.2 R33.2
+3.3V: C63.1 C64.1 L2.2 R38.2
GND: C19.1 C20.1 C27.1 C36.1 C38.1 C39.2 C62.1 C63.2 C64.2 C65.1 C66.1 C67.1 R34.1 R35.2 R40.1 R41.1 R42.1 U2.3(PGND) U2.5(AGND) U2.15(PGND) U21.4(GND)
VBUS: C19.2 C38.2 C62.2 R37.2 U2.12(VIN) U2.13(VIN) U21.1(MODE_SYNC) U21.2(VIN) U21.8(EN)
NetC37_1: C37.1 L2.1 U2.1(SW) U2.2(SW)
NetC37_2: C37.2 U2.14(BOOT)
NetC39_1: C39.1 U21.6(SS_TR)
NetC40_2: C40.2 R32.1 R34.2 U21.5(FB)
NetC65_2: C65.2 R37.1 U2.10(EN)
NetC66_2: C66.2 U2.9(SS)
NetC67_2: C67.2 R39.1
NetL1_1: L1.1 U21.3(SW)
NetR33_1: R33.1 U21.9(PG)
NetR35_1: R35.1 U21.7(COMP_FSET)
NetR38_1: R38.1 R42.2 U2.7(FB)
NetR39_2: R39.2 U2.8(COMP)
NetR40_2: R40.2 U2.6(RLIM)
NetR41_2: R41.2 U2.4(RT/SYNC)

Not connected (* = marked no-connect by the designer): U2 11(PGOOD)*

### Notes on the sheet
- Power Supply
- 3V3 Supply
- 1V2 Supply
- (near C20) 3A
- 3A
- SDB0650M4R7

### Library data of the parts
C19 C20 C27 C36 = Cap: Capacitor; Value: 0.1uF; Published: 8-Jun-2000; LatestRevisionDate: 17-Jul-2002; LatestRevisionNote: Re-released for DXP Platform.; PackageReference: RAD-0.3; Publisher: Altium Limited; PackageDescription: Radial Cap, Thru-Hole; 2 Leads; 0.3 in Pin Spacing
C37 C38 C62 C65-C67 = CAP 1206/3216: CAP CER 10UF 25V X5R 1206; Mfr. Part No.: C1206C106M3PACTU; Unit Price (USD): 0.28; Supplier Part No.: 399-8153-1-ND; Supplier: Digikey Electronics
C39 C40 = Cap: Capacitor; Published: 8-Jun-2000; LatestRevisionDate: 17-Jul-2002; LatestRevisionNote: Re-released for DXP Platform.; PackageReference: RAD-0.3; Publisher: Altium Limited; PackageDescription: Radial Cap, Thru-Hole; 2 Leads; 0.3 in Pin Spacing
C63 C64 = Capacitor-NonPolar: CAP CER 0.1UF 50V X7R 0402; Mfr. Part No.: UMK105B7104KV-FR; Value: 100nF; Unit Price (USD): 0.15; Supplier Part No.: 587-3498-1-ND; Supplier: Digikey Electronics
L1 = LQM21PN1R0MC0D: Inductor with Inductance: 1uH Tol. +/-20%, Package: 0805 _2012_; MF: Murata; MP: LQM21PN1R0MC0D; Price: None; SnapEDA_Link: https://www.snapeda.com/parts/LQM21PN1R0MC0D/Murata%20Electronics%20North%20America/view-part/51550/?ref=snap; Package: 2012 Murata; Value: *; Availability: Unavailable
L2 = INDUCTOR_2: Power inductor 4.7uH Isat=7A; Manufacturer Name: VIKING; Manufacturer P/N: SDB0650M4R7; SolidRun P/N: IN00045; MFG_PN01: SDB0650MT4R7; PCB Footprint: SDB0650; Updated: 2016-02-10 17:13:33; Manufacturer: VIKING; MFG_NAME01: VIKING; Datasheet: www.viking.com.tw/ftp/SDB.pdf; PRIORITY_PN: IN00045
R32-R35 = Res1: Resistor; Value: 10K; Published: 8-Jun-2000; LatestRevisionDate: 17-Jul-2002; LatestRevisionNote: Re-released for DXP Platform.; PackageReference: AXIAL-0.3; Publisher: Altium Limited; PackageDescription: Axial Device, Thru-Hole; 2 Leads; 0.3 in Pin Spacing
R37-R42 = Resistor: RES SMD 51 OHM 0.5% 1/16W 0402; Mfr. Part No.: ERA-2AED510X; Value: 51R; Unit Price (USD): 0.21; Supplier Part No.: P51DECT-ND; Supplier: Digikey Electronics
U2 = RT2875A/B: DC2DC chip; Manufacturer: RICHTECK; SolidRun P/N: IC00566; Manufacturer P/N: RT2875B; DataSheet: http://www.richtek.com/download_ds.jsp?p=RT2875A/RT2875B; Updated: 2016-02-10 17:13:33; PCB Footprint: TSSOP-14; Manufacturer Name: RICHTECK
U21 = TPS6281208QWRWYRQ1: No Description Available; Mfr_Name: Texas Instruments; Type: DEV; RefDes: RefDes; Copyright: Copyright (C) 2023 Ultra Librarian. All rights reserved.; Manufacturer_Part_Number: TPS6281208QWRWYRQ1; Digi-Key_Part_Number_1: 296-TPS6281208QWRWYRQ1TR-ND; Digi-Key_Part_Number_2: 296-TPS6281208QWRWYRQ1CT-ND; Digi-Key_Part_Number_3: 296-TPS6281208QWRWYRQ1DKR-ND

## Nets that join several sheets
+1.2V: 10X SD CARD READER SCH SHEET 1 (19 pins), 10X SD CARD READER SCH SHEET 3 (5 pins), 10X SD CARD READER SCH SHEET 4 (7 pins)
+3.3V: 10X SD CARD READER SCH SHEET 1 (37 pins), 10X SD CARD READER SCH SHEET 3 (5 pins), 10X SD CARD READER SCH SHEET 4 (C63.1 C64.1 L2.2 R38.2)
GND: 10X SD CARD READER SCH SHEET 1 (61 pins), 10X SD CARD READER SCH SHEET 2 (21 pins), 10X SD CARD READER SCH SHEET 3 (180 pins), 10X SD CARD READER SCH SHEET 4 (21 pins)
VBUS: 10X SD CARD READER SCH SHEET 1 (7 pins), 10X SD CARD READER SCH SHEET 2 (12 pins), 10X SD CARD READER SCH SHEET 3 (10 pins), 10X SD CARD READER SCH SHEET 4 (9 pins)
SD1: 10X SD CARD READER SCH SHEET 2 (SD1.1 U3.23), 10X SD CARD READER SCH SHEET 3 (R60.1)
SD2: 10X SD CARD READER SCH SHEET 2 (SD2.1 U3.24), 10X SD CARD READER SCH SHEET 3 (R44.1)
SD3: 10X SD CARD READER SCH SHEET 2 (SD3.1 U3.25), 10X SD CARD READER SCH SHEET 3 (R64.1)
SD4: 10X SD CARD READER SCH SHEET 2 (SD4.1 U3.26), 10X SD CARD READER SCH SHEET 3 (R66.1)
SD5: 10X SD CARD READER SCH SHEET 2 (SD5.1 U3.27), 10X SD CARD READER SCH SHEET 3 (R62.1)
USB2.0_DN_PORT1_N: 10X SD CARD READER SCH SHEET 1 (U1.6), 10X SD CARD READER SCH SHEET 3 (U10.4)
USB2.0_DN_PORT1_P: 10X SD CARD READER SCH SHEET 1 (U1.5), 10X SD CARD READER SCH SHEET 3 (U10.5)
USB2.0_DN_PORT2_N: 10X SD CARD READER SCH SHEET 1 (U1.15), 10X SD CARD READER SCH SHEET 3 (U6.4)
USB2.0_DN_PORT2_P: 10X SD CARD READER SCH SHEET 1 (U1.14), 10X SD CARD READER SCH SHEET 3 (U6.5)
USB2.0_DN_PORT3_N: 10X SD CARD READER SCH SHEET 1 (U1.28), 10X SD CARD READER SCH SHEET 3 (U8.4)
USB2.0_DN_PORT3_P: 10X SD CARD READER SCH SHEET 1 (U1.27), 10X SD CARD READER SCH SHEET 3 (U8.5)
USB2.0_DN_PORT4_N: 10X SD CARD READER SCH SHEET 1 (U1.35), 10X SD CARD READER SCH SHEET 3 (U7.4)
USB2.0_DN_PORT4_P: 10X SD CARD READER SCH SHEET 1 (U1.34), 10X SD CARD READER SCH SHEET 3 (U7.5)
USB2.0_DN_PORT5_N: 10X SD CARD READER SCH SHEET 1 (U1.82), 10X SD CARD READER SCH SHEET 3 (U9.4)
USB2.0_DN_PORT5_P: 10X SD CARD READER SCH SHEET 1 (U1.81), 10X SD CARD READER SCH SHEET 3 (U9.5)
USB2.0_DN_PORT6_N: 10X SD CARD READER SCH SHEET 1 (U1.41), 10X SD CARD READER SCH SHEET 2 (U4.5)
USB2.0_DN_PORT6_P: 10X SD CARD READER SCH SHEET 1 (U1.42), 10X SD CARD READER SCH SHEET 2 (U4.4)
USB3.0_DN_PORT1_RX_N: 10X SD CARD READER SCH SHEET 1 (U1.11), 10X SD CARD READER SCH SHEET 3 (U10.10)
USB3.0_DN_PORT1_RX_P: 10X SD CARD READER SCH SHEET 1 (U1.10), 10X SD CARD READER SCH SHEET 3 (U10.11)
USB3.0_DN_PORT1_TX_N: 10X SD CARD READER SCH SHEET 1 (U1.8), 10X SD CARD READER SCH SHEET 3 (C97.1)
USB3.0_DN_PORT1_TX_P: 10X SD CARD READER SCH SHEET 1 (U1.7), 10X SD CARD READER SCH SHEET 3 (C69.1)
USB3.0_DN_PORT2_RX_N: 10X SD CARD READER SCH SHEET 1 (U1.20), 10X SD CARD READER SCH SHEET 3 (U6.10)
USB3.0_DN_PORT2_RX_P: 10X SD CARD READER SCH SHEET 1 (U1.19), 10X SD CARD READER SCH SHEET 3 (U6.11)
USB3.0_DN_PORT2_TX_N: 10X SD CARD READER SCH SHEET 1 (U1.17), 10X SD CARD READER SCH SHEET 3 (C68.1)
USB3.0_DN_PORT2_TX_P: 10X SD CARD READER SCH SHEET 1 (U1.16), 10X SD CARD READER SCH SHEET 3 (C95.1)
USB3.0_DN_PORT3_RX_N: 10X SD CARD READER SCH SHEET 1 (U1.33), 10X SD CARD READER SCH SHEET 3 (U8.10)
USB3.0_DN_PORT3_RX_P: 10X SD CARD READER SCH SHEET 1 (U1.32), 10X SD CARD READER SCH SHEET 3 (U8.11)
USB3.0_DN_PORT3_TX_N: 10X SD CARD READER SCH SHEET 1 (U1.30), 10X SD CARD READER SCH SHEET 3 (C35.1)
USB3.0_DN_PORT3_TX_P: 10X SD CARD READER SCH SHEET 1 (U1.29), 10X SD CARD READER SCH SHEET 3 (C93.1)
USB3.0_DN_PORT4_RX_N: 10X SD CARD READER SCH SHEET 1 (U1.40), 10X SD CARD READER SCH SHEET 3 (U7.10)
USB3.0_DN_PORT4_RX_P: 10X SD CARD READER SCH SHEET 1 (U1.39), 10X SD CARD READER SCH SHEET 3 (U7.11)
USB3.0_DN_PORT4_TX_N: 10X SD CARD READER SCH SHEET 1 (U1.37), 10X SD CARD READER SCH SHEET 3 (C101.1)
USB3.0_DN_PORT4_TX_P: 10X SD CARD READER SCH SHEET 1 (U1.36), 10X SD CARD READER SCH SHEET 3 (C107.1)
USB3.0_DN_PORT5_RX_N: 10X SD CARD READER SCH SHEET 1 (U1.87), 10X SD CARD READER SCH SHEET 3 (U9.10)
USB3.0_DN_PORT5_RX_P: 10X SD CARD READER SCH SHEET 1 (U1.86), 10X SD CARD READER SCH SHEET 3 (U9.11)
USB3.0_DN_PORT5_TX_N: 10X SD CARD READER SCH SHEET 1 (U1.84), 10X SD CARD READER SCH SHEET 3 (C91.1)
USB3.0_DN_PORT5_TX_P: 10X SD CARD READER SCH SHEET 1 (U1.83), 10X SD CARD READER SCH SHEET 3 (C99.1)